# EAGLE design mobile-lipo-charger-v0001 (EAGLE 9.5.2)

## Sheet 1 of 9: MCU PSU
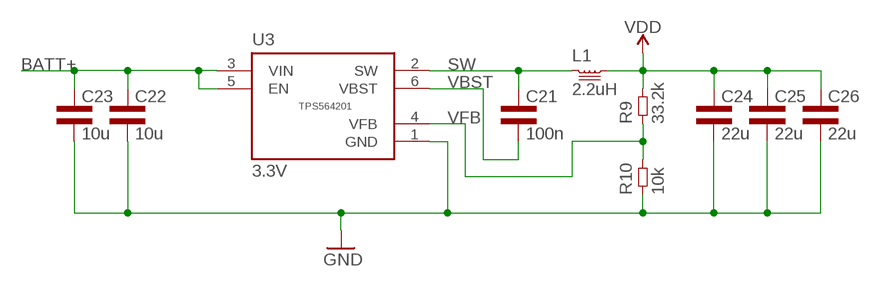
[diagram p0: schematic, sheet 1]

### Parts
C21  100n  CAP0603L3  [0603L3]
C22  10u  CAP1206L3  [1206L3]
C23  10u  CAP1206L3  [1206L3]
C24  22u  CAP0603L3  [0603L3]
C25  22u  CAP0603L3  [0603L3]
C26  22u  CAP0603L3  [0603L3]
L1  2.2uH  INDUCTOR6X6  [6X6]
R9  33.2k  RES0402L3  [0402L3]
R10  10k  RES0402L3  [0402L3]
U3  3.3V  TPS564201  [SOT-1.1]

### Nets
BATT+: C22.1 C23.1 U3.3(VIN) U3.5(EN) ; also sheet 2
GND: C22.2 C23.2 C24.P$2 C25.P$2 C26.P$2 R10.P$1 U3.1(GND) ; also sheet 2,3,4,5,6,7,8,9
SW: C21.P$1 L1.1 U3.2(SW)
VBST: C21.P$2 U3.6(VBST)
VDD: C24.P$1 C25.P$1 C26.P$1 L1.2 R9.P$2 ; also sheet 3,5,6,9
VFB: R9.P$1 R10.P$2 U3.4(VFB)

## Sheet 2 of 9: Charger PSU
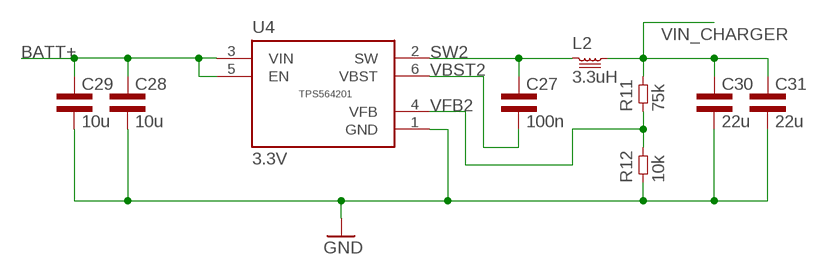
[diagram p1: schematic, sheet 2]

### Parts
C27  100n  CAP0603L3  [0603L3]
C28  10u  CAP1206L3  [1206L3]
C29  10u  CAP1206L3  [1206L3]
C30  22u  CAP0603L3  [0603L3]
C31  22u  CAP0603L3  [0603L3]
L2  3.3uH  INDUCTOR6X6  [6X6]
R11  75k  RES0402L3  [0402L3]
R12  10k  RES0402L3  [0402L3]
U4  3.3V  TPS564201  [SOT-1.1]

### Nets
BATT+: C28.1 C29.1 U4.3(VIN) U4.5(EN) ; also sheet 1
GND: C28.2 C29.2 C30.P$2 C31.P$2 R12.P$1 U4.1(GND) ; also sheet 1,3,4,5,6,7,8,9
SW2: C27.P$1 L2.1 U4.2(SW)
VBST2: C27.P$2 U4.6(VBST)
VFB2: R11.P$1 R12.P$2 U4.4(VFB)
VIN_CHARGER: C30.P$1 C31.P$1 L2.2 R11.P$2 ; also sheet 5,6

## Sheet 3 of 9: MCU
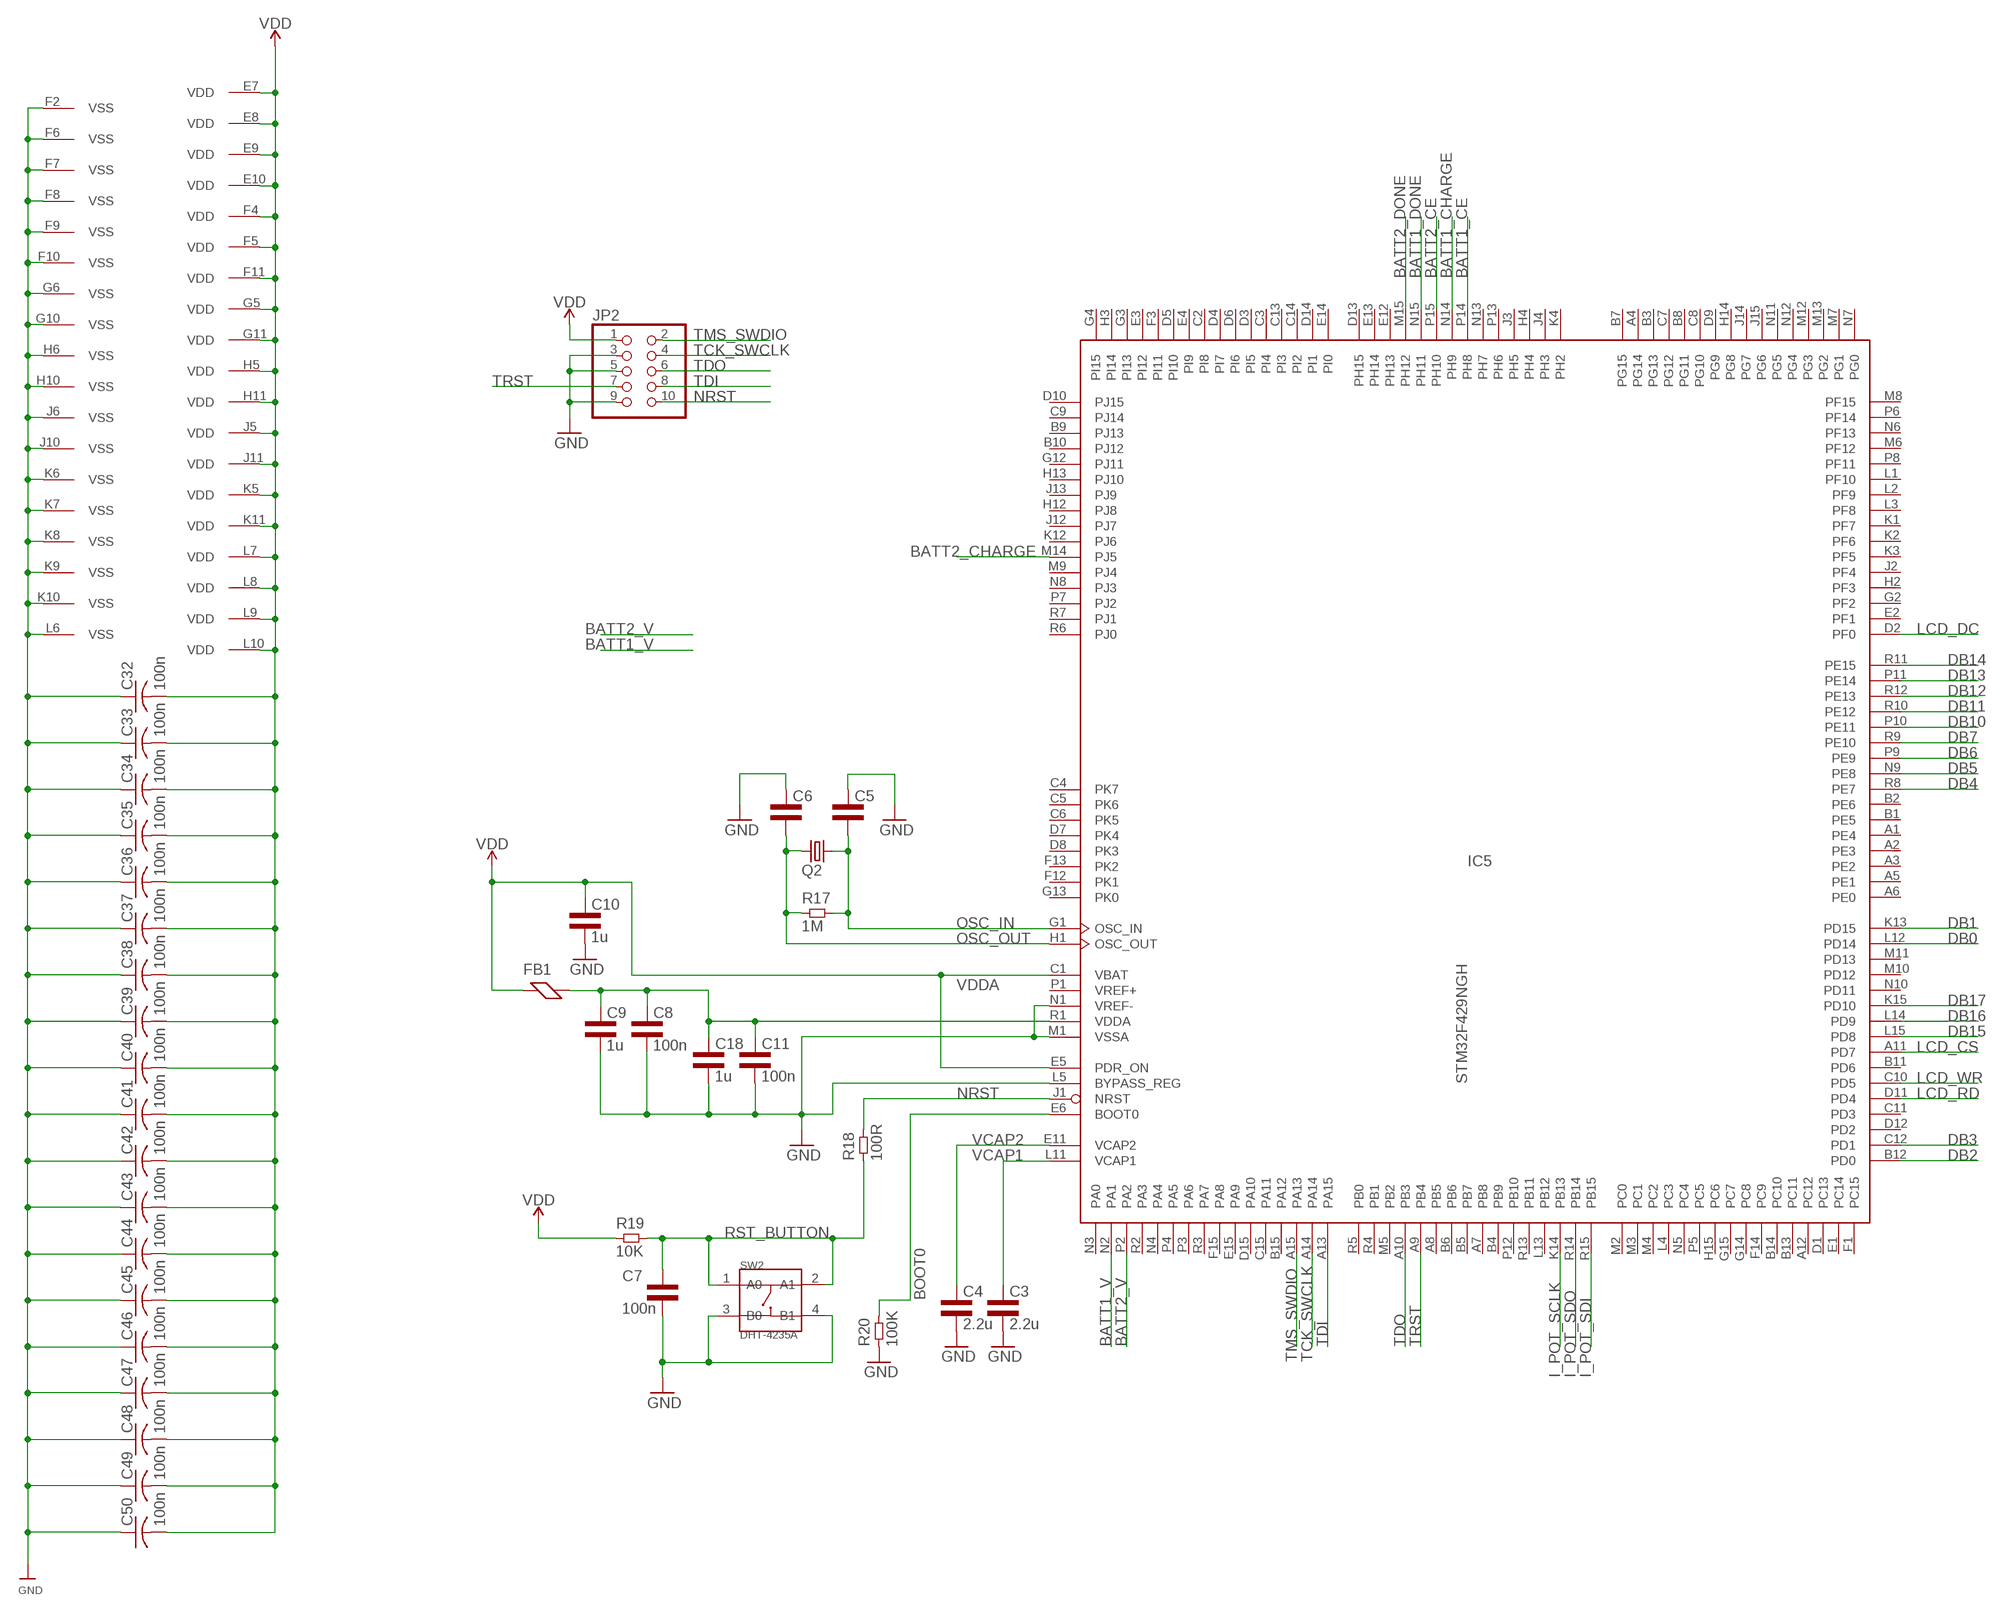
[diagram p2: schematic, sheet 3]

### Parts
C3  2.2u  CAP0805L3  [0805L3]
C4  2.2u  CAP0805L3  [0805L3]
C5  CAP0603L3  [0603L3]
C6  CAP0603L3  [0603L3]
C7  100n  CAP0402L3  [0402L3]
C8  100n  CAP0402L3  [0402L3]
C9  1u  CAP0805L3  [0805L3]
C10  1u  CAP0603L3  [0603L3]
C11  100n  CAP0402L3  [0402L3]
C18  1u  CAP0805L3  [0805L3]
C32  100n  C-USC0201  [C0201]
C33  100n  C-USC0201  [C0201]
C34  100n  C-USC0201  [C0201]
C35  100n  C-USC0201  [C0201]
C36  100n  C-USC0201  [C0201]
C37  100n  C-USC0201  [C0201]
C38  100n  C-USC0201  [C0201]
C39  100n  C-USC0201  [C0201]
C40  100n  C-USC0201  [C0201]
C41  100n  C-USC0201  [C0201]
C42  100n  C-USC0201  [C0201]
C43  100n  C-USC0201  [C0201]
C44  100n  C-USC0201  [C0201]
C45  100n  C-USC0201  [C0201]
C46  100n  C-USC0201  [C0201]
C47  100n  C-USC0201  [C0201]
C48  100n  C-USC0201  [C0201]
C49  100n  C-USC0201  [C0201]
C50  100n  C-USC0201  [C0201]
FB1  FERRITE0603L3  [0603L3]
IC5  STM32F429NGH  [TFBGA216]
JP2  PINHD-2X5  [2X05]
Q2  CRYSTALHC49US  [PCM2707_V1_SPARKFUN_HC49US]
R17  1M  RES0603L3  [0603L3]
R18  100R  RES0603L3  [0603L3]
R19  10K  RES0603L3  [0603L3]
R20  100K  RES0603L3  [0603L3]
SW2  DHT-4235A  SMD-BUTTON-TOP-DHT-4235A(4P-4.2X3.2MM)  [SW4-SMD-4.2X3.2X2.5MM]

### Nets
BATT1_CE: IC5.P14(PH8) ; also sheet 5
BATT1_CHARGE: IC5.N14(PH9) ; also sheet 5
BATT1_DONE: IC5.N15(PH11) ; also sheet 5
BATT1_V: IC5.N2(PA1) ; also sheet 8
BATT2_CE: IC5.P15(PH10) ; also sheet 6
BATT2_CHARGE: IC5.M14(PJ5) ; also sheet 6
BATT2_DONE: IC5.M15(PH12) ; also sheet 6
BATT2_V: IC5.P2(PA2) ; also sheet 8
BOOT0: IC5.E6(BOOT0) R20.P$2
DB0: IC5.L12(PD14) ; also sheet 9
DB1: IC5.K13(PD15) ; also sheet 9
DB2: IC5.B12(PD0) ; also sheet 9
DB3: IC5.C12(PD1) ; also sheet 9
DB4: IC5.R8(PE7) ; also sheet 9
DB5: IC5.N9(PE8) ; also sheet 9
DB6: IC5.P9(PE9) ; also sheet 9
DB7: IC5.R9(PE10) ; also sheet 9
DB10: IC5.P10(PE11) ; also sheet 9
DB11: IC5.R10(PE12) ; also sheet 9
DB12: IC5.R12(PE13) ; also sheet 9
DB13: IC5.P11(PE14) ; also sheet 9
DB14: IC5.R11(PE15) ; also sheet 9
DB15: IC5.L15(PD8) ; also sheet 9
DB16: IC5.L14(PD9) ; also sheet 9
DB17: IC5.K15(PD10) ; also sheet 9
GND: C3.2 C4.2 C5.P$1 C6.P$1 C7.P$2 C8.P$2 C9.2 C10.P$2 C11.P$2 C18.2 C32.1 C33.1 C34.1 C35.1 C36.1 C37.1 C38.1 C39.1 C40.1 C41.1 C42.1 C43.1 C44.1 C45.1 C46.1 C47.1 C48.1 C49.1 C50.1 IC5.F2(VSS) IC5.F6(VSS) IC5.F7(VSS) IC5.F8(VSS) IC5.F9(VSS) IC5.F10(VSS) IC5.G6(VSS) IC5.G10(VSS) IC5.H6(VSS) IC5.H10(VSS) IC5.J6(VSS) IC5.J10(VSS) IC5.K6(VSS) IC5.K7(VSS) IC5.K8(VSS) IC5.K9(VSS) IC5.K10(VSS) IC5.L5(BYPASS_REG) IC5.L6(VSS) IC5.M1(VSSA) IC5.N1(VREF-) JP2.3 JP2.5 JP2.9 R20.P$1 SW2.3(B0) SW2.4(B1) ; also sheet 1,2,4,5,6,7,8,9
I_POT_SCLK: IC5.K14(PB13) ; also sheet 7
I_POT_SDI: IC5.R15(PB15) ; also sheet 7
I_POT_SDO: IC5.R14(PB14) ; also sheet 7
LCD_CS: IC5.A11(PD7) ; also sheet 9
LCD_DC: IC5.D2(PF0) ; also sheet 9
LCD_RD: IC5.D11(PD4) ; also sheet 9
LCD_WR: IC5.C10(PD5) ; also sheet 9
NRST: IC5.J1(NRST) JP2.10 R18.P$2
OSC_IN: C5.P$2 IC5.G1(OSC_IN) Q2.2 R17.P$2
OSC_OUT: C6.P$2 IC5.H1(OSC_OUT) Q2.1 R17.P$1
RST_BUTTON: C7.P$1 R18.P$1 R19.P$2 SW2.1(A0) SW2.2(A1)
TCK_SWCLK: IC5.A14 JP2.4
TDI: IC5.A13(PA15) JP2.8
TDO: IC5.A10(PB3) JP2.6
TMS_SWDIO: IC5.A15(PA13) JP2.2
TRST: IC5.A9(PB4) JP2.7
VCAP1: C3.1 IC5.L11(VCAP1)
VCAP2: C4.1 IC5.E11(VCAP2)
VDD: C10.P$1 C32.2 C33.2 C34.2 C35.2 C36.2 C37.2 C38.2 C39.2 C40.2 C41.2 C42.2 C43.2 C44.2 C45.2 C46.2 C47.2 C48.2 C49.2 C50.2 FB1.P$1 IC5.C1(VBAT) IC5.E5(PDR_ON) IC5.E7(VDD) IC5.E8(VDD) IC5.E9(VDD) IC5.E10(VDD) IC5.F4(VDD) IC5.F5(VDD) IC5.F11(VDD) IC5.G5(VDD) IC5.G11(VDD) IC5.H5(VDD) IC5.H11(VDD) IC5.J5(VDD) IC5.J11(VDD) IC5.K5(VDD) IC5.K11(VDD) IC5.L7(VDD) IC5.L8(VDD) IC5.L9(VDD) IC5.L10(VDD) JP2.1 R19.P$1 ; also sheet 1,5,6,9
VDDA: C8.P$1 C9.1 C11.P$1 C18.1 FB1.P$2 IC5.R1(VDDA)
Unconnected: IC5.A1(PE4) IC5.A2(PE3) IC5.A3(PE2) IC5.A4(PG14) IC5.A5(PE1) IC5.A6(PE0) IC5.A7(PB8) IC5.A8(PB5) IC5.A12(PC12) IC5.B1(PE5) IC5.B2(PE6) IC5.B3(PG13) IC5.B4(PB9) IC5.B5(PB7) IC5.B6 IC5.B7(PG15) IC5.B8(PG11) IC5.B9(PJ13) IC5.B10(PJ12) IC5.B11(PD6) IC5.B13(PC11) IC5.B14(PC10) IC5.B15(PA12) IC5.C2(PI8) IC5.C3(PI4) IC5.C4(PK7) IC5.C5(PK6) IC5.C6(PK5) IC5.C7(PG12) IC5.C8(PG10) IC5.C9(PJ14) IC5.C11(PD3) IC5.C13(PI3) IC5.C14(PI2) IC5.C15(PA11) IC5.D1(PC13) IC5.D3(PI5) IC5.D4(PI7) IC5.D5(PI10) IC5.D6(PI6) IC5.D7(PK4) IC5.D8(PK3) IC5.D9(PG9) IC5.D10(PJ15) IC5.D12(PD2) IC5.D13(PH15) IC5.D14(PI1) IC5.D15(PA10) IC5.E1(PC14) IC5.E2(PF1) IC5.E3(PI12) IC5.E4(PI9) IC5.E12(PH13) IC5.E13(PH14) IC5.E14(PI0) IC5.E15(PA9) IC5.F1(PC15) IC5.F3(PI11) IC5.F12(PK1) IC5.F13(PK2) IC5.F14(PC9) IC5.F15(PA8) IC5.G2(PF2) IC5.G3(PI13) IC5.G4(PI15) IC5.G12(PJ11) IC5.G13(PK0) IC5.G14(PC8) IC5.G15(PC7) IC5.H2(PF3) IC5.H3(PI14) IC5.H4 IC5.H12(PJ8) IC5.H13(PJ10) IC5.H14(PG8) IC5.H15(PC6) IC5.J2(PF4) IC5.J3(PH5) IC5.J4(PH3) IC5.J12(PJ7) IC5.J13(PJ9) IC5.J14(PG7) IC5.J15(PG6) IC5.K1(PF7) IC5.K2(PF6) IC5.K3(PF5) IC5.K4(PH2) IC5.K12(PJ6) IC5.L1(PF10) IC5.L2(PF9) IC5.L3(PF8) IC5.L4(PC3) IC5.L13(PB12) IC5.M2(PC0) IC5.M3(PC1) IC5.M4(PC2) IC5.M5(PB2) IC5.M6(PF12) IC5.M7(PG1) IC5.M8(PF15) IC5.M9(PJ4) IC5.M10(PD12) IC5.M11(PD13) IC5.M12(PG3) IC5.M13(PG2) IC5.N3(PA0) IC5.N4(PA4) IC5.N5(PC4) IC5.N6(PF13) IC5.N7(PG0) IC5.N8(PJ3) IC5.N10(PD11) IC5.N11(PG5) IC5.N12(PG4) IC5.N13(PH7) IC5.P3(PA6) IC5.P4(PA5) IC5.P5(PC5) IC5.P6(PF14) IC5.P7(PJ2) IC5.P8(PF11) IC5.P12(PB10) IC5.P13(PH6) IC5.R2(PA3) IC5.R3(PA7) IC5.R4(PB1) IC5.R5(PB0) IC5.R6(PJ0) IC5.R7(PJ1) IC5.R13(PB11)

## Sheet 4 of 9: BATT TRAY
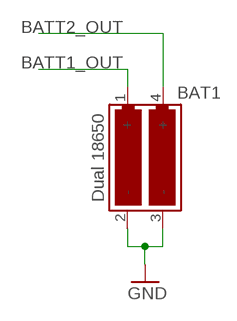
[diagram p3: schematic, sheet 4]

### Parts
BAT1  KEYSTONE1048  [KEYSTONE1048]

### Nets
BATT1_OUT: BAT1.1(+) ; also sheet 5,8
BATT2_OUT: BAT1.4(+) ; also sheet 6,8
GND: BAT1.2(-) BAT1.3(-) ; also sheet 1,2,3,5,6,7,8,9

## Sheet 5 of 9: Batt Charger 1
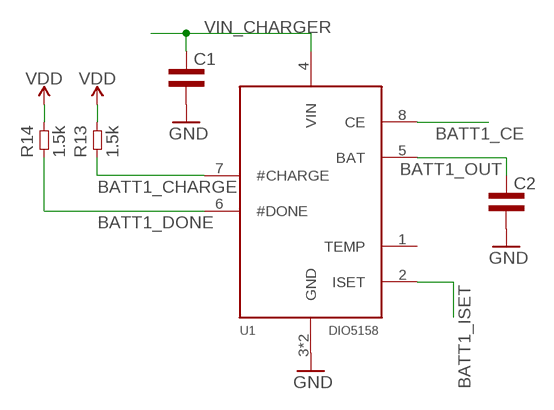
[diagram p4: schematic, sheet 5]

### Parts
C1  CAP0805L3  [0805L3]
C2  CAP0805L3  [0805L3]
R13  1.5k  RES0603L3  [0603L3]
R14  1.5k  RES0603L3  [0603L3]
U1  DIO5158XS8  [EP-MSOP8]

### Nets
BATT1_CE: U1.8(CE) ; also sheet 3
BATT1_CHARGE: R13.P$1 U1.7(#CHARGE) ; also sheet 3
BATT1_DONE: R14.P$1 U1.6(#DONE) ; also sheet 3
BATT1_ISET: U1.2(ISET) ; also sheet 7
BATT1_OUT: C2.1 U1.5(BAT) ; also sheet 4,8
GND: C1.2 C2.2 U1.3(GND) U1.TP(GND) ; also sheet 1,2,3,4,6,7,8,9
VDD: R13.P$2 R14.P$2 ; also sheet 1,3,6,9
VIN_CHARGER: C1.1 U1.4(VIN) ; also sheet 2,6
Unconnected: U1.1(TEMP)

## Sheet 6 of 9: Batt Charger 2
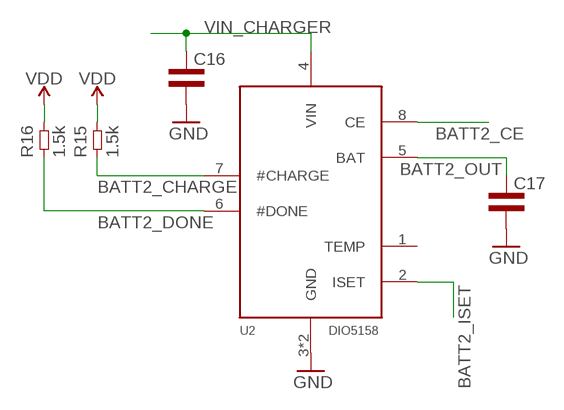
[diagram p5: schematic, sheet 6]

### Parts
C16  CAP0805L3  [0805L3]
C17  CAP0805L3  [0805L3]
R15  1.5k  RES0603L3  [0603L3]
R16  1.5k  RES0603L3  [0603L3]
U2  DIO5158XS8  [EP-MSOP8]

### Nets
BATT2_CE: U2.8(CE) ; also sheet 3
BATT2_CHARGE: R15.P$1 U2.7(#CHARGE) ; also sheet 3
BATT2_DONE: R16.P$1 U2.6(#DONE) ; also sheet 3
BATT2_ISET: U2.2(ISET) ; also sheet 7
BATT2_OUT: C17.1 U2.5(BAT) ; also sheet 4,8
GND: C16.2 C17.2 U2.3(GND) U2.TP(GND) ; also sheet 1,2,3,4,5,7,8,9
VDD: R15.P$2 R16.P$2 ; also sheet 1,3,5,9
VIN_CHARGER: C16.1 U2.4(VIN) ; also sheet 2,5
Unconnected: U2.1(TEMP)

## Sheet 7 of 9: Charge Current Pot
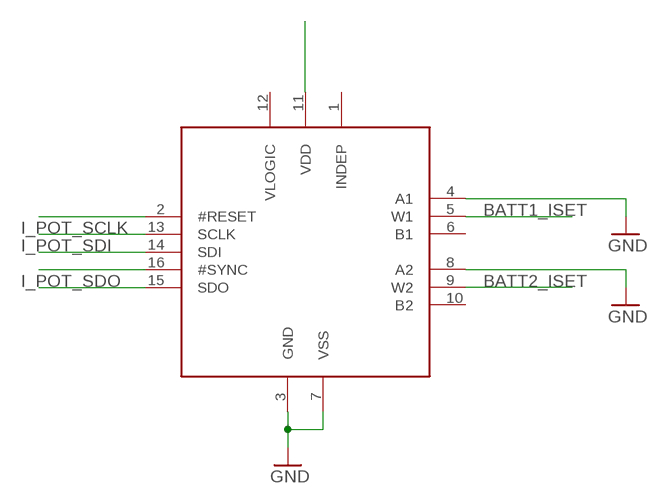
[diagram p6: schematic, sheet 7]

### Parts
U$1  AD5122BRUZ10  [TSSOP-RU-16]

### Nets
BATT1_ISET: U$1.5(W1) ; also sheet 5
BATT2_ISET: U$1.9(W2) ; also sheet 6
GND: U$1.3(GND) U$1.4(A1) U$1.7(VSS) U$1.8(A2) ; also sheet 1,2,3,4,5,6,8,9
I_POT_SCLK: U$1.13(SCLK) ; also sheet 3
I_POT_SDI: U$1.14(SDI) ; also sheet 3
I_POT_SDO: U$1.15(SDO) ; also sheet 3
N$1: U$1.2(#RESET)
N$2: U$1.11(VDD)
N$4: U$1.16(#SYNC)
Unconnected: U$1.1(INDEP) U$1.6(B1) U$1.10(B2) U$1.12(VLOGIC)

## Sheet 8 of 9: ADC Buffer
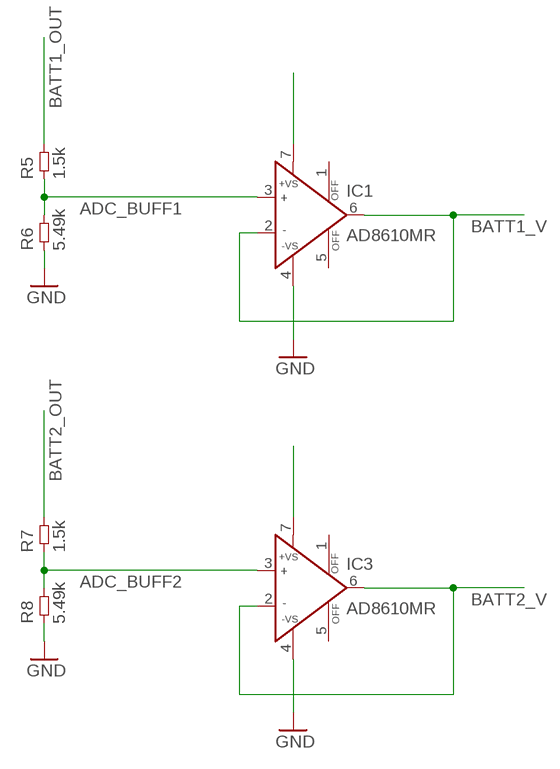
[diagram p7: schematic, sheet 8]

### Parts
IC1  AD8610MR  [MSOP08]
IC3  AD8610MR  [MSOP08]
R5  1.5k  RES0603L3  [0603L3]
R6  5.49k  RES0603L3  [0603L3]
R7  1.5k  RES0603L3  [0603L3]
R8  5.49k  RES0603L3  [0603L3]

### Nets
ADC_BUFF1: IC1.3(IN+) R5.P$1 R6.P$2
ADC_BUFF2: IC3.3(IN+) R7.P$1 R8.P$2
BATT1_OUT: R5.P$2 ; also sheet 4,5
BATT1_V: IC1.2(IN-) IC1.6(OUT) ; also sheet 3
BATT2_OUT: R7.P$2 ; also sheet 4,6
BATT2_V: IC3.2(IN-) IC3.6(OUT) ; also sheet 3
GND: IC1.4(-VS) IC3.4(-VS) R6.P$1 R8.P$1 ; also sheet 1,2,3,4,5,6,7,9
N$8: IC3.7(+VS)
N$9: IC1.7(+VS)
Unconnected: IC1.1(OFF) IC1.5(OFF) IC3.1(OFF) IC3.5(OFF)

## Sheet 9 of 9: TFT Connector
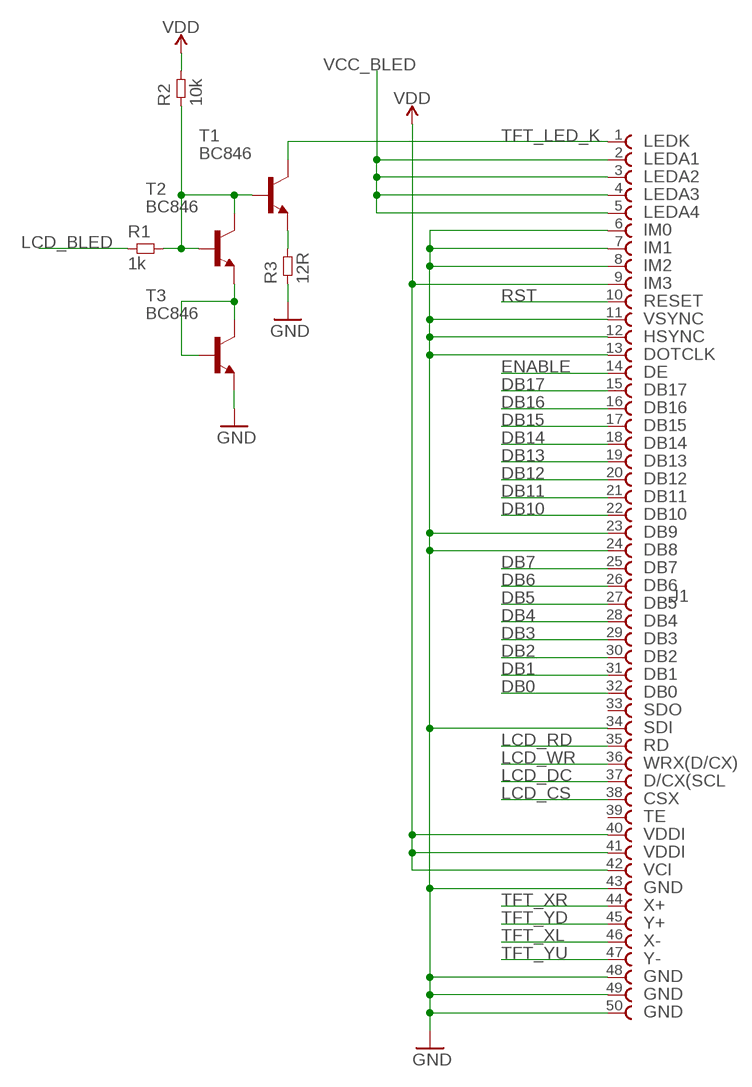
[diagram p8: schematic, sheet 9]

### Parts
J1  68715014022  [68715014022]
R1  1k  RES0603L3  [0603L3]
R2  10k  RES0603L3  [0603L3]
R3  12R  RES0603L3  [0603L3]
T1  BC846  [SOT23]
T2  BC846  [SOT23]
T3  BC846  [SOT23]

### Nets
DB0: J1.32 ; also sheet 3
DB1: J1.31 ; also sheet 3
DB2: J1.30 ; also sheet 3
DB3: J1.29 ; also sheet 3
DB4: J1.28 ; also sheet 3
DB5: J1.27 ; also sheet 3
DB6: J1.26 ; also sheet 3
DB7: J1.25 ; also sheet 3
DB10: J1.22 ; also sheet 3
DB11: J1.21 ; also sheet 3
DB12: J1.20 ; also sheet 3
DB13: J1.19 ; also sheet 3
DB14: J1.18 ; also sheet 3
DB15: J1.17 ; also sheet 3
DB16: J1.16 ; also sheet 3
DB17: J1.15 ; also sheet 3
ENABLE: J1.14
GND: J1.6 J1.7 J1.8 J1.11 J1.12 J1.13 J1.23 J1.24 J1.34 J1.43 J1.48 J1.49 J1.50 R3.P$1 T3.2(E) ; also sheet 1,2,3,4,5,6,7,8
LCD_BLED: R1.P$1
LCD_CS: J1.38 ; also sheet 3
LCD_DC: J1.37 ; also sheet 3
LCD_RD: J1.35 ; also sheet 3
LCD_WR: J1.36 ; also sheet 3
N$5: T2.2(E) T3.1(B) T3.3(C)
N$6: R3.P$2 T1.2(E)
N$7: R1.P$2 R2.P$1 T1.1(B) T2.1(B) T2.3(C)
RST: J1.10
TFT_LED_K: J1.1 T1.3(C)
TFT_XL: J1.46
TFT_XR: J1.44
TFT_YD: J1.45
TFT_YU: J1.47
VCC_BLED: J1.2 J1.3 J1.4 J1.5
VDD: J1.9 J1.40 J1.41 J1.42 R2.P$2 ; also sheet 1,3,5,6
Unconnected: J1.33 J1.39

### Notes on the sheet
- LEDK
- LEDA1
- LEDA2
- LEDA3
- LEDA4
- IM0
- IM1
- IM2
- IM3
- RESET
- VSYNC
- HSYNC
- DOTCLK
- DE
- DB17
- DB16
- DB15
- DB14
- DB13
- DB12
- DB11
- DB10
- DB9
- DB8
- DB7
- DB6
- DB5
- DB4
- DB3
- DB2
- DB1
- DB0
- SDO
- SDI
- RD
- WRX(D/CX)
- D/CX(SCL
- CSX
- TE
- VDDI
- VDDI
- VCI
- GND
- X+
- Y+
- X-
- Y-
- GND
- GND
- GND

## Power pins joined to a net without a drawn wire
VREF+: IC5.P1(VREF+)

## Library data of the parts
BAT1 = common:KEYSTONE1048
C1 C2 C5-C11 C16-C18 C21-C31 = common:CAP
C3 C4 = common:CAP; DATASHEET: https://www.mouser.com/datasheet/2/40/TAJ_LOW_PROFILE-932651.pdf; MANUFACTURER: AVX; PART-NUM: 581-TAJR225K016RNJ; VENDOR: mouser.com
C32-C50 = rcl:C-US: CAPACITOR, American symbol; SPICEPREFIX: C
FB1 = common:FERRITE
IC1 IC3 = analog-devices:AD8610: Precision, Very Low Noise, Low Input Bias Current, Wide Bandwidth JFET Operational Amplifiers Source: http://www.analog.com/static/imported-files/data_sheets/AD8610_8620.pdf; MF: ALTERA CORPORATION; MPN: AD8610ARMZ-REEL; OC_FARNELL: 1424175; OC_NEWARK: 59K6939
IC5 = micro-stm_v3:STM32F429N*H: ARM 32-bit Cortex™-M3 CPU 180 MHz maximum frequency 1024 to 2048 Kbytes of Flash memory 256 kbytes of SRAM 168 GPIOs 1.8 to 3.6 V application supply
J1 = Wurth_Elektronik_Electromechanic_FPC_Connectors_&_Flat_Flexible_Cable_rev16a:68715014022: WR-FPC 0.5mm SMT ZIF Horizontal Top Contact, 50 Pins=>Code : Con_FPC_ZIF_0.50_68715014022 <http://katalog.we-online.de/media/images/eican/Con_FPC_ZIF_0.50_6871xx14022_pf2.jpg> Details see: http://katalog.we-online.de/en/em/687_1xx_140_22 Created 2014-07-09, Karrer Zheng 2014 (C) Würth Elektronik
JP2 = pinhead:PINHD-2X5: PIN HEADER
L1 = common:INDUCTOR; DATASHEET: https://www.mouser.com/datasheet/2/400/nductor_commercial_power_vls6045ex_en-776394.pdf; MANUFACTURER: TDK; PART-NUM: 810-VLS6045EX-2R2N; VENDOR: Mouser
L2 = common:INDUCTOR; DATASHEET: https://www.mouser.com/datasheet/2/400/nductor_commercial_power_vls6045ex_en-776394.pdf; MANUFACTURER: TDK; PART-NUM: 810-VLS6045EX-3R3N; VENDOR: Mouser
Q2 = my_dac_amp:CRYSTAL: Crystals Various standard crystals. Proven footprints. Spark Fun Electronics SKU : COM-00534
R1-R3 R5-R20 = common:RES
SW2 = Seeed-Switch:SMD-BUTTON-TOP-DHT-4235A(4P-4.2X3.2MM): 311020045; MPN: DHT-4235A
T1-T3 = transistor:BC846: NPN TRANSISTOR
U1 U2 = common:DIO5158
U3 U4 = common:TPS564201: The TPS564201 is a simple, easy-to-use, 4-A synchronous step-down converter in SOT-23 package. The device is optimized to operate with minimum external component count and also optimized to achieve low standby current. These switch mode power supply (SMPS) devices employ D-CAP2 mode control providing a fast transient response and supporting both lowequivalent series resistance (ESR) output capacitors such as specialty polymer and ultra-low ESR ceramic capacitors with no external compensation components. The TPS564201 operates in pulse skip mode, maintaining high efficiency during light load operation. The TPS564201 is available in a 6-pin 1.6-mm × 2.9- mm SOT (DDC) package, and specified from a –40°C to 125°C junction temperature.
U$1 = common:AD5122; DATASHEET: https://www.mouser.com/datasheet/2/609/AD5122_5142-1501502.pdf; MANUFACTURER: Analog Devices; PART-NUM: 584-AD5122BRUZ10; VENDOR: Mouser

## Board
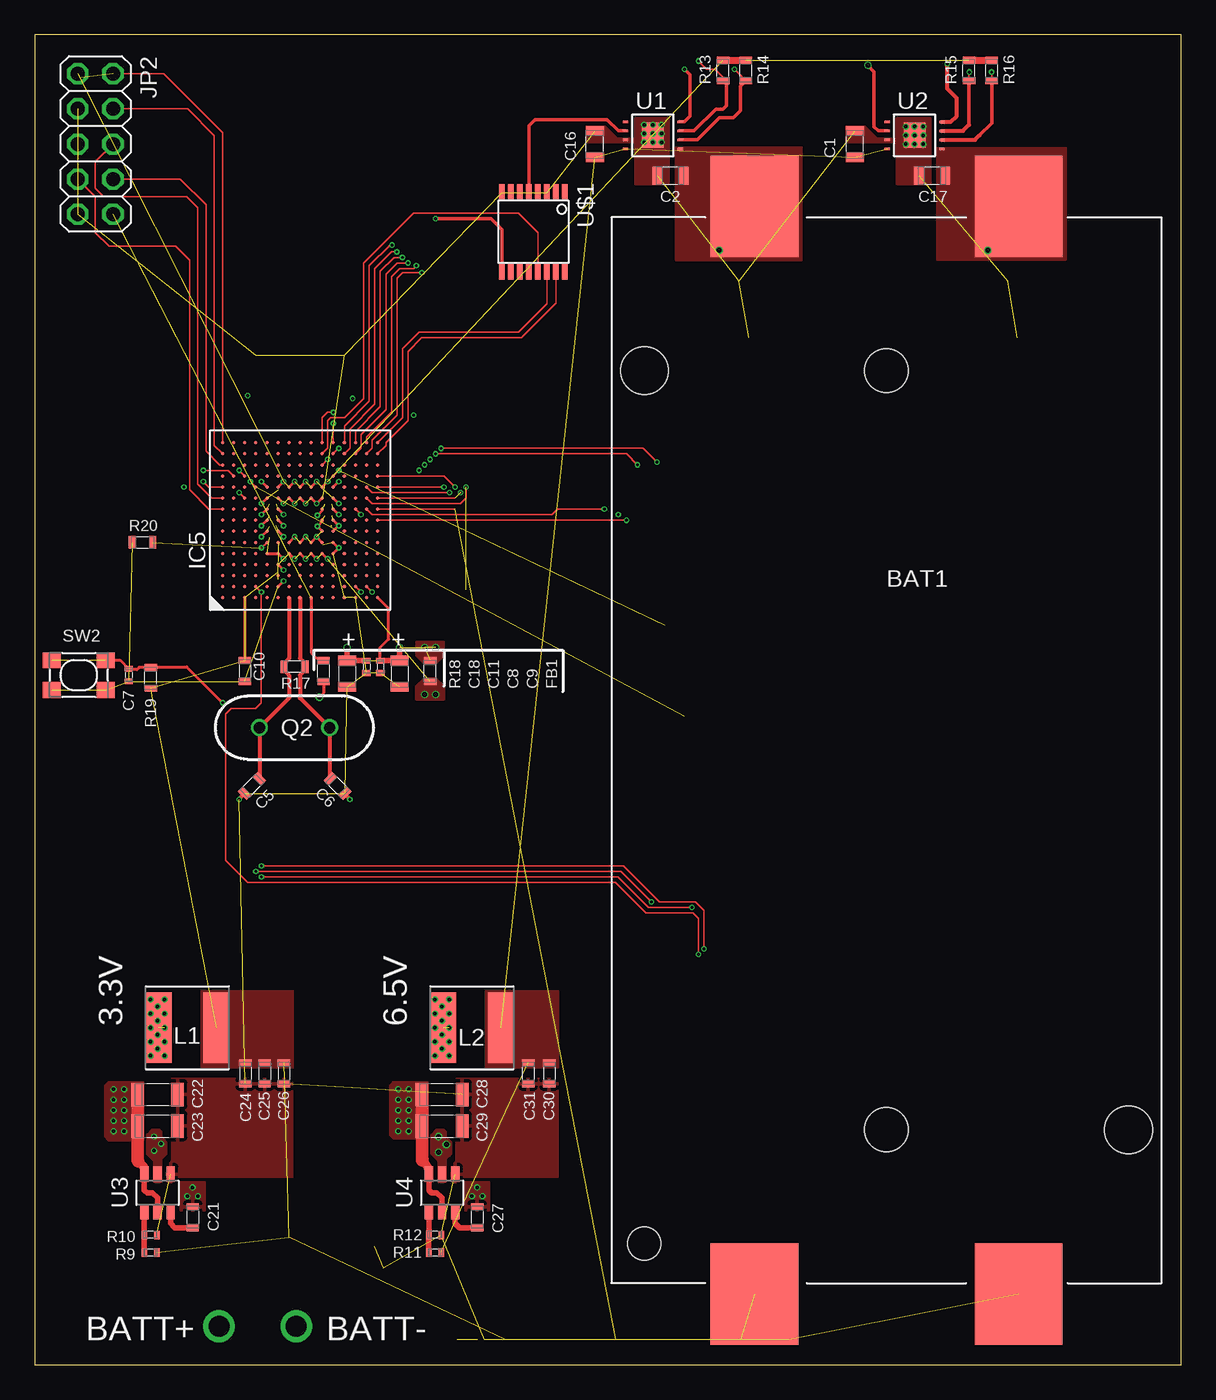
[diagram p9: board, top side]
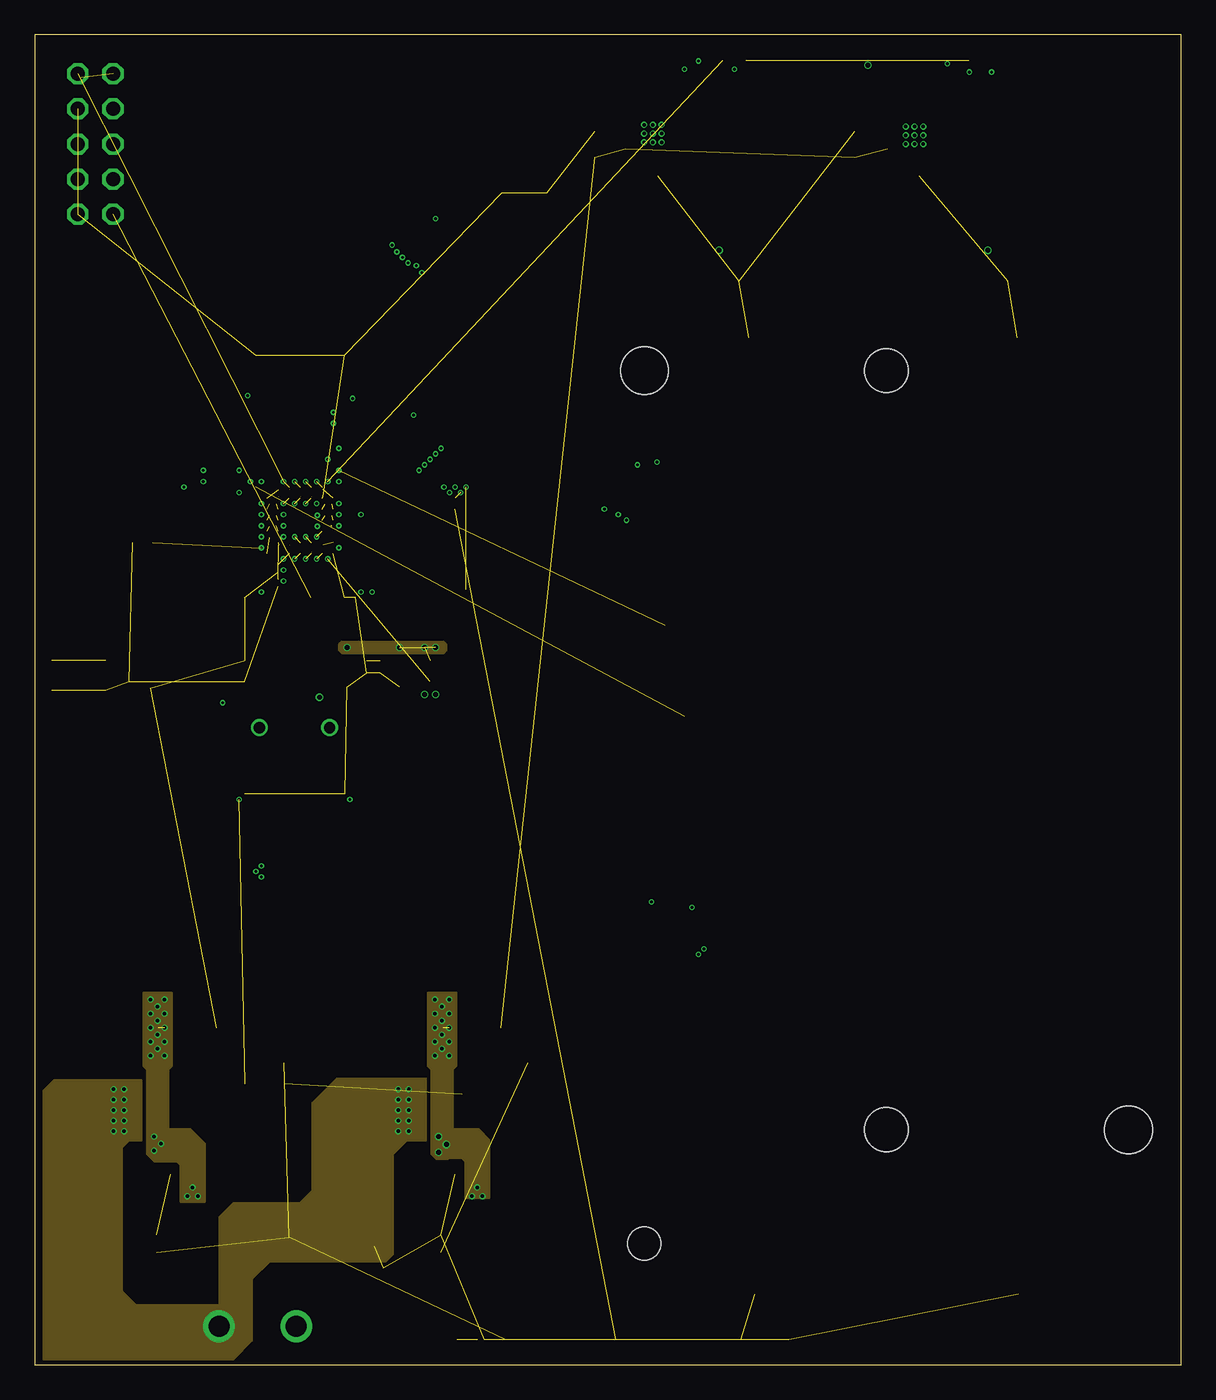
[diagram p10: board, inner layer Route2]
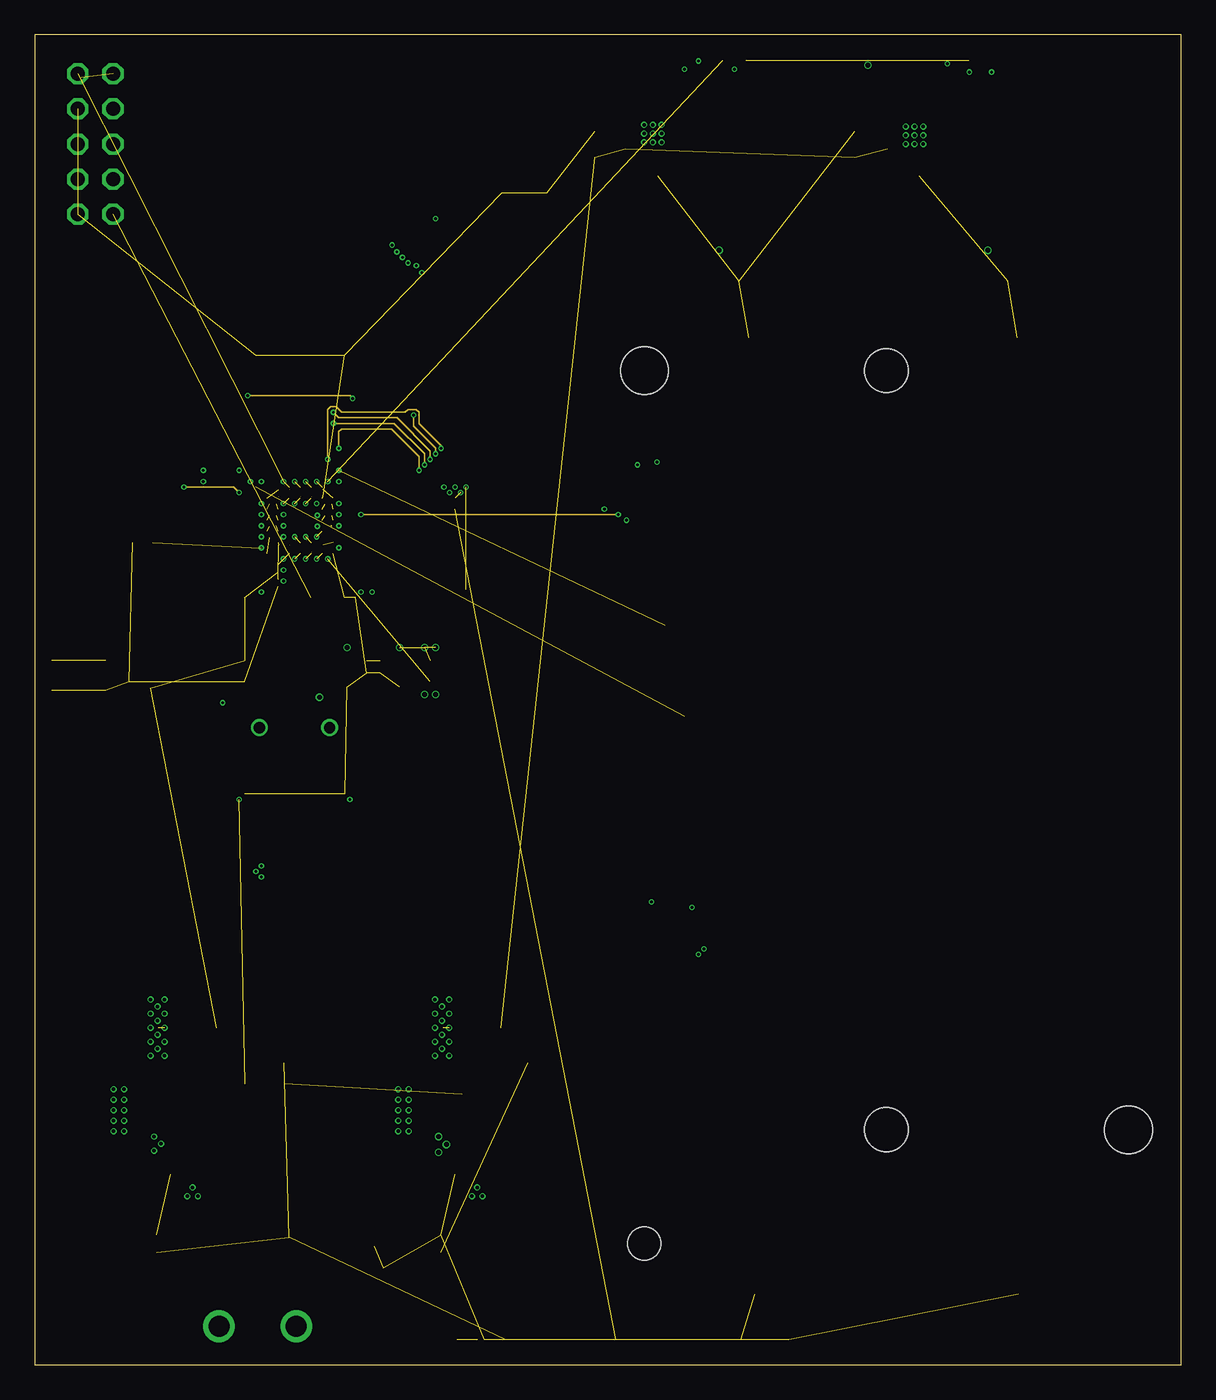
[diagram p11: board, inner layer Route3]
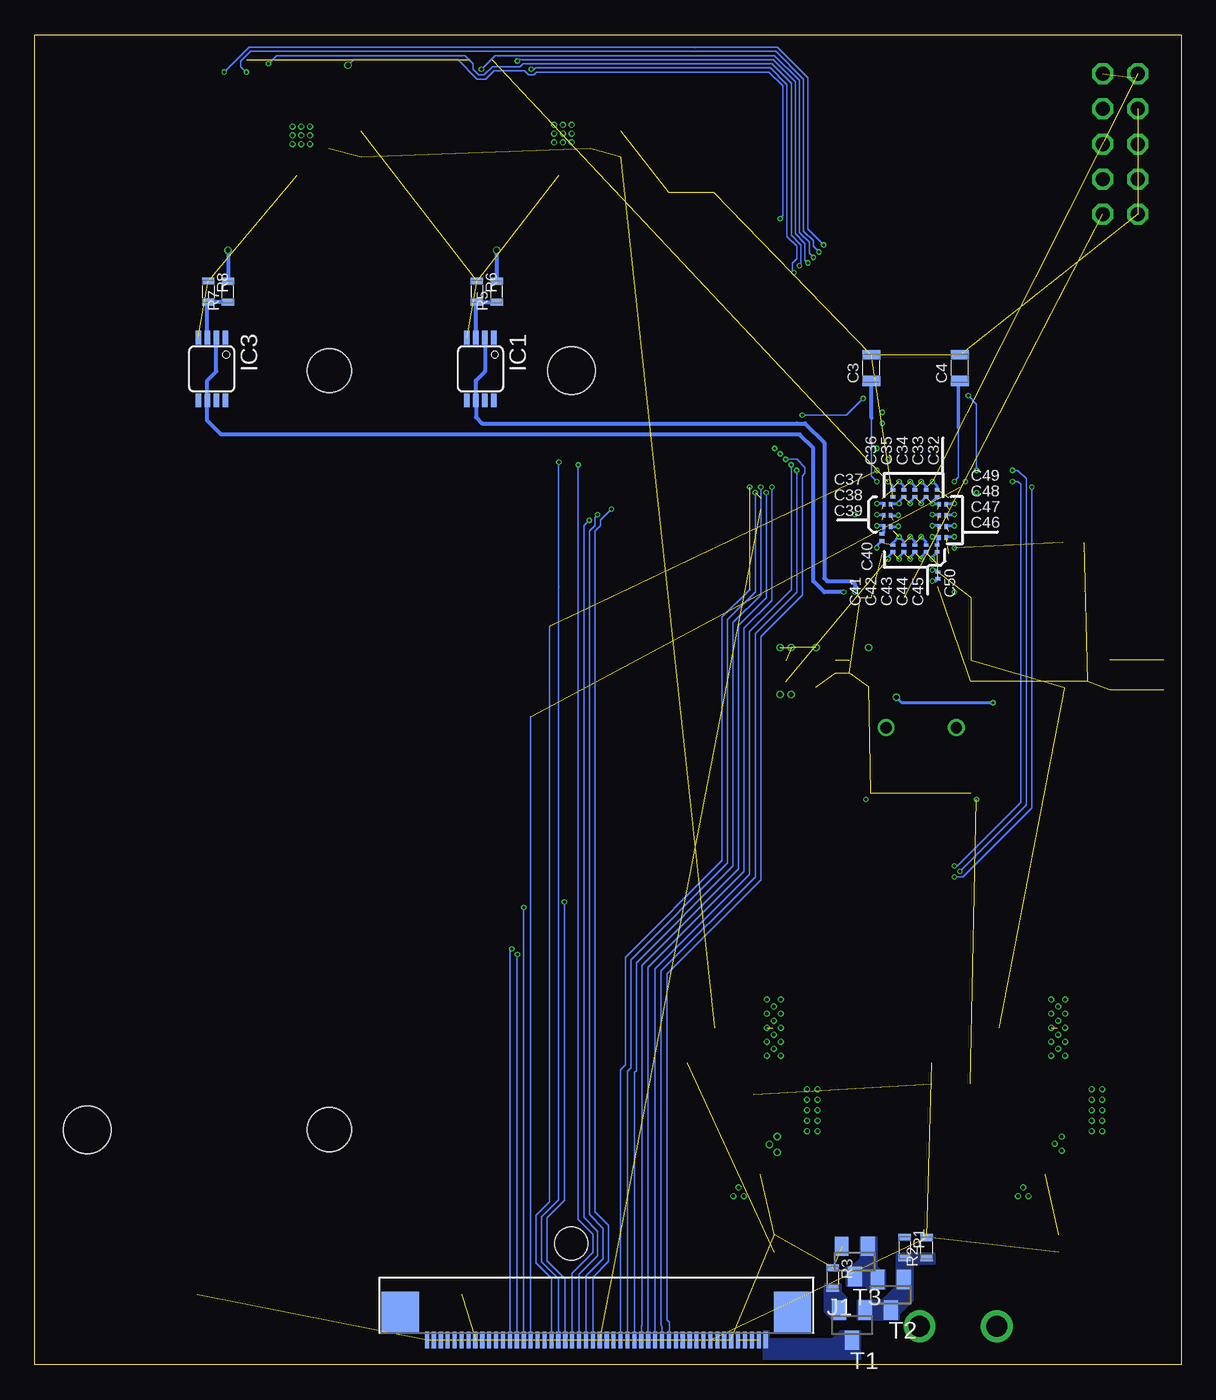
[diagram p12: board, bottom side, seen from below]

Size 82.91 x 96.19 mm. Coordinates in mm from the lower left corner, seen from the top.
Outline: 0,0 82.91,0 82.91,96.19 0,96.19 0,0
Copper layers (1*2*3*16): Top 0.035mm / dielectric 1.5mm / Route2 0.035mm / dielectric 0.15mm / Route3 0.035mm / dielectric 0.2mm / Bottom 0.035mm
Design rules "default *": minimum track width 3.5mil, minimum drill 8mil, track to track 3.5mil, track to pad 3.5mil, pad to pad 3.5mil, via to via 3.5mil, smd to smd 3.5mil, copper to edge 13mil, drill to drill 6mil, minimum pad ring 3.5mil, minimum via ring 3.5mil, stop-mask expansion 2mil, vias tented up to drill 10mil, thermal gap 10mil

### Footprints (pad centres in the part's own frame; a part is rotated, then mirrored left to right if it is on the bottom)
KEYSTONE1048 = smd 6.35 x 7.34: 1 -9.555,39.33; 2 -9.555,-39.33; 3 9.555,-39.33; 4 9.555,39.33 | hole 3.17: 0,27.44; 0,-27.44 | hole 3.45: -17.505,27.44; 17.505,-27.44 | hole 2.39: -17.505,-35.66
0805L3 = smd 0.7 x 1.3: 1 -0.95,0; 2 0.95,0
0603L3 = smd 0.5 x 0.9: P$1 -0.75,0; P$2 0.75,0
0402L3 = smd 0.4 x 0.6: P$1 -0.45,0; P$2 0.45,0
1206L3 = smd 0.9 x 1.7: 1 -1.45,0; 2 1.45,0
C0201 = smd 0.25 x 0.35: 1 -0.25,0; 2 0.25,0
MSOP08 = smd 0.4 x 1: 1 -0.976,-2.263; 2 -0.326,-2.263; 3 0.324,-2.263; 4 0.974,-2.263; 5 0.974,2.262; 6 0.324,2.262; 7 -0.326,2.262; 8 -0.976,2.262
TFBGA216 = smd 0.25 x 0.25: A1 -5.6,5.6; A2 -4.8,5.6; A3 -4,5.6; A4 -3.2,5.6; A5 -2.4,5.6; A6 -1.6,5.6; A7 -0.8,5.6; A8 0,5.6; A9 0.8,5.6; A10 1.6,5.6; A11 2.4,5.6; A12 3.2,5.6; A13 4,5.6; A14 4.8,5.6; A15 5.6,5.6; B1 -5.6,4.8; B2 -4.8,4.8; B3 -4,4.8; B4 -3.2,4.8; B5 -2.4,4.8; B6 -1.6,4.8; B7 -0.8,4.8; B8 0,4.8; B9 0.8,4.8; B10 1.6,4.8; B11 2.4,4.8; B12 3.2,4.8; B13 4,4.8; B14 4.8,4.8; B15 5.6,4.8; C1 -5.6,4; C2 -4.8,4; C3 -4,4; C4 -3.2,4; C5 -2.4,4; C6 -1.6,4; C7 -0.8,4; C8 0,4; C9 0.8,4; C10 1.6,4; C11 2.4,4; C12 3.2,4; C13 4,4; C14 4.8,4; C15 5.6,4; D1 -5.6,3.2; D2 -4.8,3.2; D3 -4,3.2; D4 -3.2,3.2; D5 -2.4,3.2; D6 -1.6,3.2; D7 -0.8,3.2; D8 0,3.2; D9 0.8,3.2; D10 1.6,3.2; D11 2.4,3.2; D12 3.2,3.2; D13 4,3.2; D14 4.8,3.2; D15 5.6,3.2; E1 -5.6,2.4; E2 -4.8,2.4; E3 -4,2.4; E4 -3.2,2.4; E5 -2.4,2.4; E6 -1.6,2.4; E7 -0.8,2.4; E8 0,2.4; E9 0.8,2.4; E10 1.6,2.4; E11 2.4,2.4; E12 3.2,2.4; E13 4,2.4; E14 4.8,2.4; E15 5.6,2.4; F1 -5.6,1.6; F2 -4.8,1.6; F3 -4,1.6; F4 -3.2,1.6; F5 -2.4,1.6; F6 -1.6,1.6; F7 -0.8,1.6; F8 0,1.6; F9 0.8,1.6; F10 1.6,1.6; F11 2.4,1.6; F12 3.2,1.6; F13 4,1.6; F14 4.8,1.6; F15 5.6,1.6; G1 -5.6,0.8; G2 -4.8,0.8; G3 -4,0.8; G4 -3.2,0.8; G5 -2.4,0.8; G6 -1.6,0.8; G10 1.6,0.8; G11 2.4,0.8; G12 3.2,0.8; G13 4,0.8; G14 4.8,0.8; G15 5.6,0.8; H1 -5.6,0; H2 -4.8,0; H3 -4,0; H4 -3.2,0; H5 -2.4,0; H6 -1.6,0; H10 1.6,0; H11 2.4,0; H12 3.2,0; H13 4,0; H14 4.8,0; H15 5.6,0; J1 -5.6,-0.8; J2 -4.8,-0.8; J3 -4,-0.8; J4 -3.2,-0.8; J5 -2.4,-0.8; J6 -1.6,-0.8; J10 1.6,-0.8; J11 2.4,-0.8; J12 3.2,-0.8; J13 4,-0.8; J14 4.8,-0.8; J15 5.6,-0.8; K1 -5.6,-1.6; K2 -4.8,-1.6; K3 -4,-1.6; K4 -3.2,-1.6; K5 -2.4,-1.6; K6 -1.6,-1.6; K7 -0.8,-1.6; K8 0,-1.6; K9 0.8,-1.6; K10 1.6,-1.6; K11 2.4,-1.6; K12 3.2,-1.6; K13 4,-1.6; K14 4.8,-1.6; K15 5.6,-1.6; L1 -5.6,-2.4; L2 -4.8,-2.4; L3 -4,-2.4; L4 -3.2,-2.4; L5 -2.4,-2.4; L6 -1.6,-2.4; L7 -0.8,-2.4; L8 0,-2.4; L9 0.8,-2.4; L10 1.6,-2.4; L11 2.4,-2.4; L12 3.2,-2.4; L13 4,-2.4; L14 4.8,-2.4; L15 5.6,-2.4; M1 -5.6,-3.2; M2 -4.8,-3.2; M3 -4,-3.2; M4 -3.2,-3.2; M5 -2.4,-3.2; M6 -1.6,-3.2; M7 -0.8,-3.2; M8 0,-3.2; M9 0.8,-3.2; M10 1.6,-3.2; M11 2.4,-3.2; M12 3.2,-3.2; M13 4,-3.2; M14 4.8,-3.2; M15 5.6,-3.2; N1 -5.6,-4; N2 -4.8,-4; N3 -4,-4; N4 -3.2,-4; N5 -2.4,-4; N6 -1.6,-4; N7 -0.8,-4; N8 0,-4; N9 0.8,-4; N10 1.6,-4; N11 2.4,-4; N12 3.2,-4; N13 4,-4; N14 4.8,-4; N15 5.6,-4; P1 -5.6,-4.8; P2 -4.8,-4.8; P3 -4,-4.8; P4 -3.2,-4.8; P5 -2.4,-4.8; P6 -1.6,-4.8; P7 -0.8,-4.8; P8 0,-4.8; P9 0.8,-4.8; P10 1.6,-4.8; P11 2.4,-4.8; P12 3.2,-4.8; P13 4,-4.8; P14 4.8,-4.8; P15 5.6,-4.8; R1 -5.6,-5.6; R2 -4.8,-5.6; R3 -4,-5.6; R4 -3.2,-5.6; R5 -2.4,-5.6; R6 -1.6,-5.6; R7 -0.8,-5.6; R8 0,-5.6; R9 0.8,-5.6; R10 1.6,-5.6; R11 2.4,-5.6; R12 3.2,-5.6; R13 4,-5.6; R14 4.8,-5.6; R15 5.6,-5.6
68715014022 = smd 0.3 x 1.2: 1 -12.25,0.6; 2 -11.75,0.6; 3 -11.25,0.6; 4 -10.75,0.6; 5 -10.25,0.6; 6 -9.75,0.6; 7 -9.25,0.6; 8 -8.75,0.6; 9 -8.25,0.6; 10 -7.75,0.6; 11 -7.25,0.6; 12 -6.75,0.6; 13 -6.25,0.6; 14 -5.75,0.6; 15 -5.25,0.6; 16 -4.75,0.6; 17 -4.25,0.6; 18 -3.75,0.6; 19 -3.25,0.6; 20 -2.75,0.6; 21 -2.25,0.6; 22 -1.75,0.6; 23 -1.25,0.6; 24 -0.75,0.6; 25 -0.25,0.6; 26 0.25,0.6; 27 0.75,0.6; 28 1.25,0.6; 29 1.75,0.6; 30 2.25,0.6; 31 2.75,0.6; 32 3.25,0.6; 33 3.75,0.6; 34 4.25,0.6; 35 4.75,0.6; 36 5.25,0.6; 37 5.75,0.6; 38 6.25,0.6; 39 6.75,0.6; 40 7.25,0.6; 41 7.75,0.6; 42 8.25,0.6; 43 8.75,0.6; 44 9.25,0.6; 45 9.75,0.6; 46 10.25,0.6; 47 10.75,0.6; 48 11.25,0.6; 49 11.75,0.6; 50 12.25,0.6 | smd 2.7 x 3: 51 -14.18,-1.38; 52 14.18,-1.38
2X05 = drill 1.016 octagon: 1 -5.08,-1.27; 2 -5.08,1.27; 3 -2.54,-1.27; 4 -2.54,1.27; 5 0,-1.27; 6 0,1.27; 7 2.54,-1.27; 8 2.54,1.27; 9 5.08,-1.27; 10 5.08,1.27
6X6 = smd 1.9 x 5.1: 1 -2.1,0; 2 2.1,0
PCM2707_V1_SPARKFUN_HC49US = drill 0.813: 1 -2.54,0; 2 2.54,0
SW4-SMD-4.2X3.2X2.5MM = smd 1.3 x 1.15: 1 -1.95,1.075; 2 1.95,1.075; 3 -1.95,-1.075; 4 1.95,-1.075
SOT23 = smd 1 x 1.4: 1 -0.95,-1.1; 2 0.95,-1.1; 3 0,1.1
EP-MSOP8 = smd 0.38 x 0.2: 1 -1.975,0.975; 2 -1.975,0.325; 3 -1.975,-0.325; 4 -1.975,-0.975; 5 1.975,-0.975; 6 1.975,-0.325; 7 1.975,0.325; 8 1.975,0.975 | smd 1.55 x 1.8: TP 0,0
SOT-1.1 = smd 1.1 x 0.6: 1 -1.35,0.95; 2 -1.35,0; 3 -1.35,-0.95; 4 1.35,-0.95; 5 1.35,0; 6 1.35,0.95
TSSOP-RU-16 = smd 1.2 x 0.4: 1 -2.85,2.275; 2 -2.85,1.625; 3 -2.85,0.975; 4 -2.85,0.325; 5 -2.85,-0.325; 6 -2.85,-0.975; 7 -2.85,-1.625; 8 -2.85,-2.275; 9 2.85,-2.275; 10 2.85,-1.625; 11 2.85,-0.975; 12 2.85,-0.325; 13 2.85,0.325; 14 2.85,0.975; 15 2.85,1.625; 16 2.85,2.275

### Placement (x,y rotation side)
BAT1  61.59,44.45 0 top
C1  59.31,88.27 90 top
C2  45.97,85.98 180 top
C3  22.4,72.08 90 bottom
C4  16,72.08 90 bottom
C5  15.72,41.86 45 top
C6  21.91,41.86 135 top
C7  6.8,49.88 270 top
C8  25,50.48 270 top
C9  26.4,49.98 270 top
C10  15.2,50.18 270 top
C11  24,50.48 270 top
C16  40.51,88.27 90 top
C17  64.9,85.98 180 top
C18  22.6,49.98 270 top
C21  11.43,10.67 270 top
C22  8.89,19.56 0 top
C23  8.89,17.27 0 top
C24  15.24,21.08 270 top
C25  16.64,21.08 270 top
C26  18.03,21.08 270 top
C27  32,10.67 270 top
C28  29.46,19.56 0 top
C29  29.46,17.27 0 top
C30  37.21,21.08 270 top
C31  35.69,21.08 270 top
C32  17.65,63.03 90 bottom
C33  18.45,63.03 90 bottom
C34  19.25,63.03 90 bottom
C35  20.05,63.03 90 bottom
C36  20.85,63.03 90 bottom
C37  21.25,62.23 180 bottom
C38  21.25,61.43 180 bottom
C39  21.25,60.63 180 bottom
C40  21.65,59.83 90 bottom
C41  20.85,59.03 270 bottom
C42  20.05,59.03 270 bottom
C43  19.25,59.03 270 bottom
C44  18.45,59.03 270 bottom
C45  17.65,59.03 270 bottom
C46  17.25,59.83 0 bottom
C47  17.25,60.63 0 bottom
C48  17.25,61.43 0 bottom
C49  17.25,62.23 0 bottom
C50  17.6,57.08 90 bottom
FB1  28.6,50.18 90 top
IC1  50.67,72.01 180 bottom
IC3  70.1,72.01 180 bottom
IC5  19.2,61.08 90 top
J1  42.29,2.41 180 bottom
JP2  4.4,88.28 270 top
L1  11.05,24.38 0 top
L2  31.62,24.38 0 top
Q2  18.8,46.08 180 top
R1  20,8.48 270 bottom
R2  18.4,8.48 90 bottom
R3  25.2,6.28 270 bottom
R5  49.49,77.6 90 bottom
R6  50.93,77.6 270 bottom
R7  68.93,77.6 90 bottom
R8  70.36,77.6 270 bottom
R9  8.38,8.13 0 top
R10  8.38,9.4 180 top
R11  28.96,8.13 0 top
R12  28.96,9.4 180 top
R13  49.78,93.6 90 top
R14  51.44,93.6 90 top
R15  67.56,93.6 90 top
R16  69.22,93.6 90 top
R17  18.8,50.48 180 top
R18  20.9,50.18 90 top
R19  8.4,49.68 90 top
R20  7.8,59.48 0 top
SW2  3.2,49.88 0 top
T1  23.8,2.88 180 bottom
T2  21,5.08 180 bottom
T3  23.6,7.48 180 bottom
U1  44.7,88.9 0 top
U2  63.63,88.9 0 top
U3  8.89,12.45 270 top
U4  29.46,12.45 270 top
U$1  36.07,81.92 270 top

### Tracks (layer width: path | path; a pad name or v marks a point on that pad's centre or on a via)
ADC_BUFF1
  Bottom 0.305: IC1.3 51,76.78 R6.P$2 R5.P$1
ADC_BUFF2
  Bottom 0.305: R7.P$1 R8.P$2 70.43,76.78 IC3.3
BATT1_CE  (via drill 0.2)
  Top 0.102: IC5.P14 24.4,66.28 24.4,66.88 26.2,68.68 26.2,78.58 26.6,78.98 v28,78.98
  Top 0.254: U1.8 47,89.88 47.4,90.28 47.4,93.28 v47,93.68
  Bottom 0.102: v47,93.68 46.8,93.68 46.7,93.78 29.7,93.78 28.5,92.58 28.5,81.58 27.8,80.88 27.8,79.98 28.1,79.68 28.1,79.08 v28,78.98
BATT1_CHARGE  (via drill 0.2)
  Top 0.102: IC5.N14 23.6,66.28 23.6,67.28 25.4,69.08 25.4,78.88 26.2,79.68 v27,79.68 | R13.P$1 49.78,93.09 49.2,93.68 48.6,93.68 v48,94.28
  Top 0.254: U1.7 47.7,89.23 49.28,90.81 49.78,90.81 50.04,91.06 50.04,92.59 R13.P$1
  Bottom 0.102: v27,79.68 27.2,79.88 27.2,81.08 27.9,81.78 27.9,92.78 29.5,94.38 47.9,94.38 v48,94.28
BATT1_DONE  (via drill 0.2)
  Top 0.102: IC5.N15 23.2,67.48 25,69.28 25,79.08 26,80.08 v26.6,80.08 | R14.P$1 v50.61,93.68 v50.6,93.68
  Top 0.254: U1.6 47.94,88.58 49.53,90.17 50.55,90.17 51.05,90.68 51.05,92.47 R14.P$1
  Bottom 0.102: v26.6,80.08 26.9,80.38 26.9,81.18 27.6,81.88 27.6,92.88 29.4,94.68 49.6,94.68 v50.6,93.68
BATT1_ISET
  Top 0.254: U$1.5 35.74,89.59 36.2,90.04 41.4,90.04 42.22,89.23 U1.2
BATT1_OUT  (via drill 0.35)
  Bottom 0.305: v49.49,80.59 R5.P$2
  pour Top (no thermals): 46.35,88.01 46.35,79.88 55.5,79.88 55.5,88.01
BATT1_V  (via drill 0.2)
  Top 0.102: IC5.N2 v23.6,55.88
  Bottom 0.305: IC1.2 50.35,71.83 51,71.18 IC1.6 51,68.52 50.55,68.07 27.8,68.07 27.19,68.07 25.8,66.68 25.8,56.88 25.6,56.68 23.8,56.68 23.6,56.48 v23.6,55.88
BATT2_CE  (via drill 0.2)
  Top 0.102: v27.6,79.48 27.4,79.28 26.4,79.28 25.8,78.68 25.8,68.88 24,67.08 IC5.P15
  Top 0.305: U2.8 66.25,89.88 66.67,90.3 66.67,91.6 66,92.28 v66,94.08
  Bottom 0.102: v66,94.08 65.4,94.68 51.8,94.68 51.2,94.08 51.2,93.68 50.8,93.28 50.4,93.28 49.8,93.88 47.8,93.88 47.6,94.08 29.6,94.08 28.2,92.68 28.2,81.68 27.5,80.98 27.5,79.58 v27.6,79.48
BATT2_CHARGE  (via drill 0.2)
  Top 0.102: IC5.M14 22.8,66.28 22.8,67.68 24.6,69.48 24.6,79.28 25.8,80.48 v26.2,80.48 | R15.P$1 67.56,93.44 v67.6,93.48
  Top 0.254: 67.56,89.66 R15.P$1
  Top 0.305: U2.7 67.13,89.23 67.56,89.66
  Bottom 0.102: v26.2,80.48 26.6,80.88 26.6,81.28 27.3,81.98 27.3,92.98 29.3,94.98 67.3,94.98 68,94.28 68,93.88 v67.6,93.48
BATT2_DONE  (via drill 0.2)
  Top 0.102: IC5.M15 22.4,67.88 24.2,69.68 24.2,79.48 25.69,80.97 v25.85,80.97 | R16.P$1 69.22,93.46 v69.2,93.48
  Top 0.254: R16.P$1 69.22,89.79 68.33,88.9
  Top 0.305: U2.6 68,88.58 68.33,88.9
  Bottom 0.102: v25.85,80.97 27,82.12 27,93.08 29.2,95.28 35.15,95.28 35.17,95.25 | 35.18,95.25 35.17,95.25 | 35.17,95.25 35.2,95.28 67.4,95.28 v69.2,93.48
BATT2_ISET  (via drill 0.2, 0.35)
  Top 0.102: 33.8,80.39 33.79,80.38
  Top 0.254: U$1.9 33.79,80.38 | v60.25,93.97 60.71,93.52 60.71,89.53 61.02,89.23 U2.2 | v29,82.88 33,82.88 33.8,82.08 33.8,80.39
  Bottom 0.102: v60.25,93.97 59.84,94.38 52.3,94.38 50.9,92.98 50.3,92.98 49.7,93.58 47.5,93.58 47.2,93.28 46.8,93.28 46.6,93.48 29.8,93.48 28.8,92.48 28.8,83.08 v29,82.88
BATT2_OUT  (via drill 0.35)
  Bottom 0.305: v68.93,80.59 R7.P$2
  pour Top (no thermals): 74.55,79.88 65.28,79.88 65.28,88.01 74.55,88.01
BATT2_V  (via drill 0.2)
  Top 0.102: IC5.P2 v24.4,55.88
  Bottom 0.305: IC3.2 69.78,71.83 70.43,71.18 IC3.6 70.43,68.27 69.44,67.28 27.6,67.28 26.6,66.28 26.6,56.68 25.8,55.88 v24.4,55.88
BATT+  (via drill 0.25 pad 0.1, 1.52 pad 0.1)
  Top 0.406: U3.3 7.94,12.63 8.13,12.45 8.51,12.45 8.89,12.06 U3.5 | U4.3 28.51,12.63 28.7,12.45 29.08,12.45 29.46,12.06 U4.5
  Top 0.61: U3.3 7.94,14.29 7.49,14.73 | U4.3 28.51,14.16 28.07,14.86
  Top 0.889: C22.1 C23.1 7.44,14.79 7.49,14.73 | 28.07,14.86 28.01,14.81 C29.1 C28.1
  other vias: 13.34,2.79 5.71,19.94 6.48,19.94 5.71,19.18 6.48,19.18 5.71,18.41 6.48,18.41 5.71,17.65 6.48,17.65 5.71,16.89 6.48,16.89 26.29,16.89 27.05,16.89 27.05,17.65 26.29,17.65 26.29,18.41 27.05,18.41 27.05,19.18 26.29,19.18 26.29,19.94 27.05,19.94
  pour Route2: 13.34,4.32 7.37,4.32 6.35,5.33 6.35,15.75 6.86,16.26 7.75,16.26 7.75,20.57 1.4,20.57 0.64,19.81 0.64,0.38 14.35,0.38 15.75,1.78 15.75,6.22 17.02,7.49 25.4,7.49 25.91,8 25.91,15.24 26.92,16.26 28.32,16.26 28.32,20.7 21.84,20.7 20.07,18.92 20.07,12.57 19.18,11.68 14.35,11.68 13.34,10.67
  pour Top (no thermals): 7.87,20.45 5.33,20.45 5.08,20.19 5.08,16.51 5.33,16.26 7.87,16.26
  pour Top (no thermals): 28.45,20.45 25.91,20.45 25.65,20.19 25.65,16.64 25.91,16.38 28.45,16.38
BATT-  (via drill 1.52 pad 0.1)
  other vias: 18.92,2.79
BOOT0  (via drill 0.2)  (1 unrouted)
  Top 0.102: IC5.E6 v16.4,59.08
DB0  (via drill 0.2)  (1 unrouted)
  Top 0.102: IC5.L12 v22,64.68
  Bottom 0.102: 45.6,53.48 45.67,53.41 45.67,11.78 46.65,10.8 46.65,7.38 45.54,6.27 J1.32
DB1  (via drill 0.2)
  Top 0.102: IC5.K13 v21.2,65.48 | v29.4,66.28 44,66.28 v45,65.28
  Route3 0.102: v21.2,65.48 21.2,69.08 21.4,69.28 21.8,69.28 22.2,68.88 26.8,68.88 27,69.08 27.6,69.08 27.8,68.88 27.8,68.08 29.4,66.48 v29.4,66.28
  Bottom 0.102: 45,56.28 45.04,56.24 | J1.31 45.04,6.24 46.26,7.46 46.26,10.72 45.04,11.94 45.04,56.24 | v45,65.28 45.04,65.24 45.04,56.24
DB2  (via drill 0.2)
  Top 0.102: IC5.B12 14,64.68 v12.2,64.68 | v16,35.68 42.4,35.68 v44.6,33.48
  Bottom 0.102: J1.30 44.54,6.21 45.87,7.54 45.87,10.64 44.6,11.91 v44.6,33.48 | v12.2,64.68 11.8,64.68 11.2,64.08 11.2,40.48 v16,35.68
DB3  (via drill 0.2)
  Top 0.102: IC5.C12 v14.8,64.68 | v29,65.88 42.8,65.88 v43.6,65.08
  Route3 0.102: v23,69.88 22.8,70.08 v15.4,70.08 | v29,65.88 29,66.28 27.4,67.88 v27.4,68.68
  Bottom 0.102: J1.29 44.04,6.61 42.51,8.14 42.51,9.44 43.6,10.53 43.6,63.28 43.6,63.48 v43.6,65.08 | v14.8,64.68 14.8,69.48 v15.4,70.08 | v27.4,68.68 24.2,68.68 v23,69.88
DB4  (via drill 0.2)
  Top 0.102: IC5.R8 v42.8,61.08
  Bottom 0.102: J1.28 43.54,6.54 42.2,7.88 42.2,9.68 43.2,10.68 43.2,60.68 v42.8,61.08
DB5  (via drill 0.2)
  Top 0.102: IC5.N9 v23.6,61.48
  Route3 0.102: v23.6,61.48 v42.2,61.48
  Bottom 0.102: J1.27 43.04,6.44 41.8,7.68 41.8,9.88 42.8,10.88 42.8,60.28 42.4,60.68 42.4,61.28 v42.2,61.48
DB6  (via drill 0.2)
  Top 0.102: IC5.P9 24.4,61.48 37.4,61.48 37.8,61.88 v41.2,61.88
  Bottom 0.102: J1.26 42.54,6.34 41.4,7.48 41.4,10.08 42.4,11.08 42.4,60.28 42,60.68 42,61.08 v41.2,61.88
DB7  (1 unrouted)
  Top 0.102: IC5.R9 30.4,61.88
DB10  (via drill 0.2)  (1 unrouted)
  Top 0.102: IC5.P10 24.4,62.28 30.8,62.28 31.2,62.68 v31.2,63.48
  Bottom 0.102: J1.22 40.54,21.34 40.2,21.68 40.2,29.48 33.2,36.48 33.2,54.08 31.2,56.08
DB11  (via drill 0.2)  (1 unrouted)
  Top 0.102: IC5.R10 30.4,62.68
  Bottom 0.102: J1.21 40.04,21.24 39.8,21.48 39.8,29.28 32.8,36.28 32.8,53.88 30.8,55.88 v30.8,63.08
DB12  (via drill 0.2)
  Top 0.102: IC5.R12 29.6,64.28 v30.4,63.48
  Bottom 0.102: J1.20 39.54,21.14 39.4,21.28 39.4,29.08 32.4,36.08 32.4,53.68 30.4,55.68 v30.4,63.48
DB13  (via drill 0.2)
  Top 0.102: IC5.P11 24.4,63.08 v30,63.08
  Bottom 0.102: J1.19 39.04,2.84 39,2.88 39,28.88 32,35.88 32,53.48 30,55.48 v30,63.08
DB14  (via drill 0.2)
  Top 0.102: IC5.R11 v29.6,63.48
  Bottom 0.102: J1.18 38.54,28.74 31.6,35.68 31.6,53.28 29.6,55.28 v29.6,63.48
DB15  (via drill 0.2)
  Top 0.102: IC5.L15 v21.6,68.08
  Route3 0.102: v21.6,68.08 26,68.08 28.2,65.88 v28.2,65.08
  Bottom 0.102: J1.17 38.04,28.64 31.2,35.47 31.2,53.05 28.2,56.05 v28.2,65.08
DB16  (via drill 0.2)
  Top 0.102: IC5.L14 v22,66.28
  Route3 0.102: v22,66.28 22,67.48 22.2,67.68 25.8,67.68 27.8,65.68 v27.8,64.68
  Bottom 0.102: J1.16 37.54,2.82 37.6,2.88 37.6,28.48 30.8,35.28 30.8,52.88 27.8,55.88 v27.8,64.68
DB17  (via drill 0.2)
  Top 0.102: v21.6,68.88 21.2,68.88 20.8,68.48 IC5.K15
  Route3 0.102: v28.6,65.48 28.6,66.08 26.2,68.48 22,68.48 v21.6,68.88
  Bottom 0.102: v28.6,65.48 27.8,65.48 27.2,64.88 27.2,64.48 27.4,64.28 27.4,55.68 30.4,52.68 30.4,35.08 37.2,28.28 37.2,3.28 37,3.08 37,1.85 J1.15
GND  (via drill 0.2, 0.25)  (74 unrouted)
  Top 0.203: IC5.F10 v18,62.28 | v18.8,62.28 IC5.G10 | IC5.H10 v19.6,62.28 | IC5.J10 v20.4,62.28 | IC5.J6 v20.4,59.88 IC5.K6 | IC5.H6 v19.6,59.88 | v18.8,59.88 IC5.G6 | IC5.F7 v18,59.88 | IC5.F8 v18,60.68 | IC5.F9 v18,61.48 | IC5.K10 v20.4,62.28 | v20.4,62.28 20.38,62.3 | IC5.L6 v22,59.08 IC5.L5 | v18,56.68 IC5.F2 | IC5.K9 20.8,61.78 v20.45,61.43 | IC5.K8 20.8,60.98 v20.45,60.63 IC5.K7 | IC5.K7
  Top 0.305: C5.P$1 14.8,40.94 v14.8,40.88 | C6.P$1 22.44,41.24 v22.8,40.88
  Bottom 0.203: C34.1 19.6,62.43 v19.6,62.28 | C35.1 20.4,62.43 v20.4,62.28 20.95,62.28 C37.1 | C33.1 18.8,62.43 v18.8,62.28 | C32.1 18,62.43 v18,62.28 17.55,62.28 C49.1 | C48.1 17.55,61.48 v18,61.48 | 17.45,60.68 v18,60.68 | C43.1 19.25,59.53 v19.6,59.88 | C42.1 20.05,59.53 v20.4,59.88 20.85,59.43 C41.1 | C39.1 v20.45,60.63 | C38.1 v20.45,61.43 | C40.1 22,59.23 v22,59.08 | 17.65,56.78 17.75,56.68 v18,56.68 | v18.8,59.88 18.45,59.53 C44.1 | v18,59.88 17.55,59.88 C46.1 17.65,59.68 C45.1
  other vias: 64.26,88.27 63.63,88.27 62.99,88.27 62.99,88.9 63.63,88.9 64.26,88.9 64.26,89.53 63.63,89.53 62.99,89.53 45.34,88.39 44.7,88.39 44.07,88.39 44.07,89.03 44.7,89.03 45.34,89.03 45.34,89.66 44.7,89.66 44.07,89.66
  pour Top (no thermals): 42.55,88.65 43.31,88.65 43.43,88.77 43.43,90.17 45.85,90.17 45.85,85.34 43.43,85.34 43.43,88.27 43.31,88.39 42.55,88.39
  pour Top (no thermals): 61.47,88.65 62.23,88.65 62.36,88.77 62.36,90.17 64.77,90.17 64.77,85.34 62.36,85.34 62.36,88.27 62.23,88.39 61.47,88.39
  pour Top (no thermals): 61.98,88.65 60.96,88.65 60.07,89.53 58.67,89.53 58.67,88.39 61.98,88.39
  pour Top (no thermals): 43.05,88.65 42.16,88.65 41.27,89.53 39.88,89.53 39.88,88.9 39.88,88.52 39.88,88.39 43.05,88.39
  pour Top: 9.91,20.7 9.91,14.73 9.53,14.35 9.53,13.21 10.16,13.21 10.16,13.34 10.41,13.59 18.67,13.59 18.67,20.7
  pour Top: 30.48,20.7 30.48,14.73 30.1,14.35 30.1,13.21 30.73,13.21 30.73,13.34 30.99,13.59 37.85,13.59 37.85,20.7
I_POT_SCLK
  Top 0.102: IC5.K14 21.2,66.28 21.2,68.28 21.4,68.48 22.4,68.48 23.8,69.88 23.8,79.68 27.4,83.28 35,83.28 36.4,81.88 U$1.13
I_POT_SDI
  Top 0.102: U$1.14 37.04,76.72 35,74.68 27.8,74.68 26.6,73.48 26.6,68.48 IC5.R15
  Top 0.305: U$1.14 37.08,79.02
I_POT_SDO
  Top 0.102: U$1.15 37.69,76.77 35.2,74.28 28,74.28 27,73.28 27,68.28 25.4,66.68 25.4,66.48 IC5.R14
  Top 0.305: U$1.15 37.72,79.04
LCD_CS  (via drill 0.2)
  Top 0.102: v12.2,63.88 12.6,63.48 IC5.A11 | v48.4,30.08 48.4,32.88 47.8,33.48 45.2,33.48 42.6,36.08 v16.4,36.08
  Bottom 0.102: J1.38 48.54,29.94 v48.4,30.08 | v12.2,63.88 11.8,63.88 11.6,63.68 11.6,40.68 16.2,36.08 v16.4,36.08
LCD_DC  (via drill 0.2)
  Top 0.102: v48,29.68 48,32.28 47.6,32.68 44.2,32.68 42,34.88 15.4,34.88 13.8,36.48 13.8,47.08 14.2,47.48 16,47.48 16.4,47.88 v16.4,55.88 IC5.D2
  Bottom 0.102: J1.37 48.04,29.64 v48,29.68
LCD_RD  (via drill 0.2)  (1 unrouted)
  Top 0.102: IC5.D11 v15.6,63.88
  Bottom 0.102: J1.35 47.04,46.84 47,46.88
LCD_WR  (via drill 0.2)
  Top 0.102: IC5.C10 v14.8,63.08 | v16.4,35.28 42.2,35.28 44.4,33.08 v47.54,33.08
  Route3 0.102: v14.8,63.08 14.4,63.48 v10.8,63.48
  Bottom 0.102: J1.36 v47.54,33.08 | v16.4,35.28 15.8,35.28 10.8,40.28 v10.8,63.48
N$5
  pour Bottom (no thermals): 23.2,9.28 23.2,7.68 23.8,7.08 24.2,7.08 24.2,5.68 22.8,5.68 22.6,5.48 21.4,5.48 21.4,6.88 21.8,6.88 22,7.08 22,9.28
N$6
  pour Bottom (no thermals): 25.8,5.88 25.8,3.88 25.2,3.28 24.2,3.28 24.2,4.68 24.2,4.88 24.6,5.28 24.6,5.88
N$7
  pour Bottom (no thermals): 23.4,3.28 20.4,3.28 20.4,3.68 19.4,4.68 19.4,7.28 17.8,7.28 17.8,8.08 20.6,8.08 20.6,5.68 21.6,4.68 23.4,4.68
NRST  (1 unrouted)
  Top 0.203: R18.P$2 20.85,50.88 20.6,50.88 20,51.48 IC5.J1
OSC_IN
  Top 0.305: IC5.G1 18.4,51.08 18.05,50.73 R17.P$2 18.05,50.23 18.4,49.88 18.4,48.22 Q2.2 C5.P$2
OSC_OUT
  Top 0.305: IC5.H1 19.2,51.08 19.55,50.73 R17.P$1 19.55,50.23 19.2,49.88 19.2,48.22 Q2.1 | Q2.1 | Q2.1 21.34,42.54 21.4,42.48 21.4,42.41 C6.P$2
RST_BUTTON  (via drill 0.2, 0.35)  (1 unrouted)
  Top 0.203: R18.P$1 20.9,48.58 v20.6,48.28 | SW2.2 6.17,50.95 C7.P$1 6.85,50.28 7.4,50.28 7.55,50.43 R19.P$2 8.45,50.48 11,50.48 v13.6,47.88
  Bottom 0.203: v13.6,47.88 20.2,47.88 v20.6,48.28
SW  (via drill 0.25)  (1 unrouted)
  other vias: 11.81,12.19 11.05,12.19 11.43,12.83 8.64,15.49 9.14,16 8.64,16.51 9.4,22.35 8.38,22.35 8.89,22.86 8.38,23.37 9.4,23.37 8.89,23.88 8.38,24.38 9.4,24.38 8.89,24.89 8.38,25.4 9.4,25.4 8.89,25.91 8.38,26.42 9.4,26.42
  pour Route2: 12.32,11.81 12.32,16 11.3,17.02 8.51,17.02 8.13,16.64 8.13,15.24 8.64,14.73 10.29,14.73 10.54,14.48 10.54,11.81
  pour Top: 12.32,11.18 12.32,13.21 10.54,13.21 10.54,11.18
  pour Top (no thermals): 8.64,13.21 8.64,14.73 8.13,15.24 8.13,16.64 8.51,17.02 9.02,17.02 9.14,16.89 9.14,16.51 9.53,16.13 9.53,15.24 9.14,14.86 9.14,13.21
  pour Route2: 8.64,14.73 8.13,15.24 8.13,21.34 7.87,21.59 7.87,26.92 9.91,26.92 9.91,21.59 9.65,21.34 9.65,15.11 9.27,14.73
SW2  (via drill 0.25, 0.35)  (1 unrouted)
  other vias: 32.38,12.19 31.62,12.19 32,12.83 29.21,16.51 29.78,15.94 29.21,15.37 29.97,22.35 29.46,22.86 28.96,22.35 28.96,23.37 29.97,23.37 29.46,23.88 28.96,24.38 29.97,24.38 29.46,24.89 28.96,25.4 29.97,25.4 29.46,25.91 28.96,26.42 29.97,26.42
  pour Top: 32.89,11.18 32.89,13.21 31.11,13.21 31.11,11.18
  pour Route2: 32.89,12.06 32.89,16.26 32.13,17.02 29.08,17.02 28.7,16.64 28.7,15.24 28.96,14.99 30.86,14.99 31.11,14.73 31.11,12.06
  pour Top (no thermals): 29.21,13.21 29.21,14.73 28.7,15.24 28.7,16.64 29.08,17.02 29.59,17.02 29.72,16.89 29.72,16.51 30.1,16.13 30.1,15.24 29.72,14.86 29.72,13.21
  pour Route2: 29.08,14.86 28.7,15.24 28.7,21.34 28.45,21.59 28.45,26.92 30.48,26.92 30.48,21.59 30.23,21.34 30.23,15.24 29.84,14.86
TCK_SWCLK
  Top 0.102: IC5.A14 13,66.48 13,88.88 11.06,90.82 JP2.4
TDI
  Top 0.102: IC5.A13 13.4,65.08 12.4,66.08 12.4,83.88 10.54,85.74 JP2.8
TDO
  Top 0.102: JP2.6 4.4,87.01 4.4,85.08 5,84.48 11,84.48 11.8,83.68 11.8,63.68 12.8,62.68 IC5.A10
TFT_LED_K
  pour Bottom (no thermals): 30.2,2.48 29.8,2.48 29.8,1.88 25.2,1.88 24.6,2.48 23.2,2.48 23.2,0.28 30.2,0.28
TMS_SWDIO  (1 unrouted)
  Top 0.102: 3.39,93.08 3.4,93.08 | IC5.A15 13.6,89.08 9.32,93.36 JP2.2
TRST
  Top 0.102: JP2.7 4.4,84.47 4.4,81.88 5.4,80.88 10.2,80.88 11.2,79.88 11.2,63.28 12.6,61.88 IC5.A9
VBST
  Top 0.406: U3.6 9.84,10.23 10.15,9.92 C21.P$2
VBST2
  Top 0.406: U4.6 30.41,10.23 30.73,9.91 31.99,9.91 C27.P$2
VCAP1  (via drill 0.2)
  Top 0.203: IC5.L11 v22,63.88
  Bottom 0.102: v22,63.88 22.4,64.28 22.4,68.48
  Bottom 0.305: 22.4,68.48 C3.1
VCAP2  (via drill 0.2)
  Top 0.203: IC5.E11 v16.4,63.88
  Bottom 0.102: v16.4,63.88 16.1,64.18 16.1,67.78
  Bottom 0.254: 16.1,67.78 16.1,71.03 C4.1
VCC_BLED  (3 unrouted)
VDD  (via drill 0.2, 0.35)  (39 unrouted)
  Top 0.203: IC5.L9 v22,61.48 | IC5.F11 v18,63.88 | v18.8,63.88 IC5.G11 | IC5.H11 v19.6,63.88 | IC5.J11 v20.4,63.88 | v21.2,63.88 IC5.K11 | IC5.F4 v18,57.48 | IC5.K5 v21.2,58.28 | IC5.J5 v20.4,58.28 | IC5.G5 v18.8,58.28 | v18,58.28 IC5.F5 IC5.E5 | IC5.E10 v16.4,62.28 | IC5.E8 v16.4,60.68 | IC5.E7 v16.4,59.88 | IC5.H5 v19.6,58.28 | IC5.E9 v16.4,61.48 | IC5.L10 v22,62.28 | IC5.L8 v22,60.68 IC5.L7 | IC5.C1 C10.P$1
  Top 0.508: R13.P$2 R14.P$2 | R15.P$2 R16.P$2
  Bottom 0.203: v22,61.48 21.55,61.48 C38.2 | 21.45,60.68 v22,60.68 | C40.2 21.5,60.23 C39.2 | C49.2 16.95,62.28 v16.4,62.28 | C48.2 16.95,61.48 v16.4,61.48 | C47.2 16.95,60.68 v16.4,60.68 | C46.2 16.95,59.88 v16.4,59.88 | C41.2 21.2,58.43 v21.2,58.28 | C42.2 20.4,58.43 v20.4,58.28 | C43.2 19.6,58.43 v19.6,58.28 | C44.2 18.8,58.43 v18.8,58.28 | C45.2 18,58.43 v18,58.28 | v21.2,63.88 20.85,63.53 C36.2 | C35.2 20.05,63.53 v20.4,63.88 | v19.6,63.88 19.25,63.53 C34.2 | v18.8,63.88 18.45,63.53 C33.2 | v18,63.88 17.65,63.53 C32.2 | C37.2 21.55,62.28 v22,62.28 | C50.2 17.75,57.48 v18,57.48
  other vias: 28.2,48.48 29,48.48
  pour Top (no thermals): 18.67,27.05 18.67,21.46 12.06,21.46 12.06,27.05
  pour Top (no thermals): 29,49.68 29.6,49.08 29.6,48.08 27.6,48.08 27.6,49.08 28.2,49.68
VDDA  (via drill 0.35)  (4 unrouted)
  Top 0.203: IC5.R1 25.6,54.68 25.6,52.48 25,51.88 C8.P$1
  Top 0.406: C11.P$1 C18.1 v22.6,51.88 | C8.P$1 C9.1 v26.4,51.88
  other vias: 28.2,51.88 29,51.88
  pour Top (no thermals): 29,50.68 29.6,51.28 29.6,52.28 27.6,52.28 27.6,51.28 28.2,50.68
  pour Route2: 29.6,52.28 22.2,52.28 22,52.08 22,51.68 22.2,51.48 29.6,51.48 29.8,51.68 29.8,52.08
VFB
  Top 0.406: U3.4 R10.P$2 R9.P$1
VFB2
  Top 0.406: U4.4 R12.P$2 R11.P$1
VIN_CHARGER  (5 unrouted)
  pour Top (no thermals): 37.85,27.05 37.85,21.46 32.64,21.46 32.64,27.05

### Text on the board
tPlace: + | + | BATT+ | BATT-
tNames: 3.3V | 6.5V